# Altium schematic sheet SHEET_DISPLAYBOARD_V1beta.SchDoc
size A0
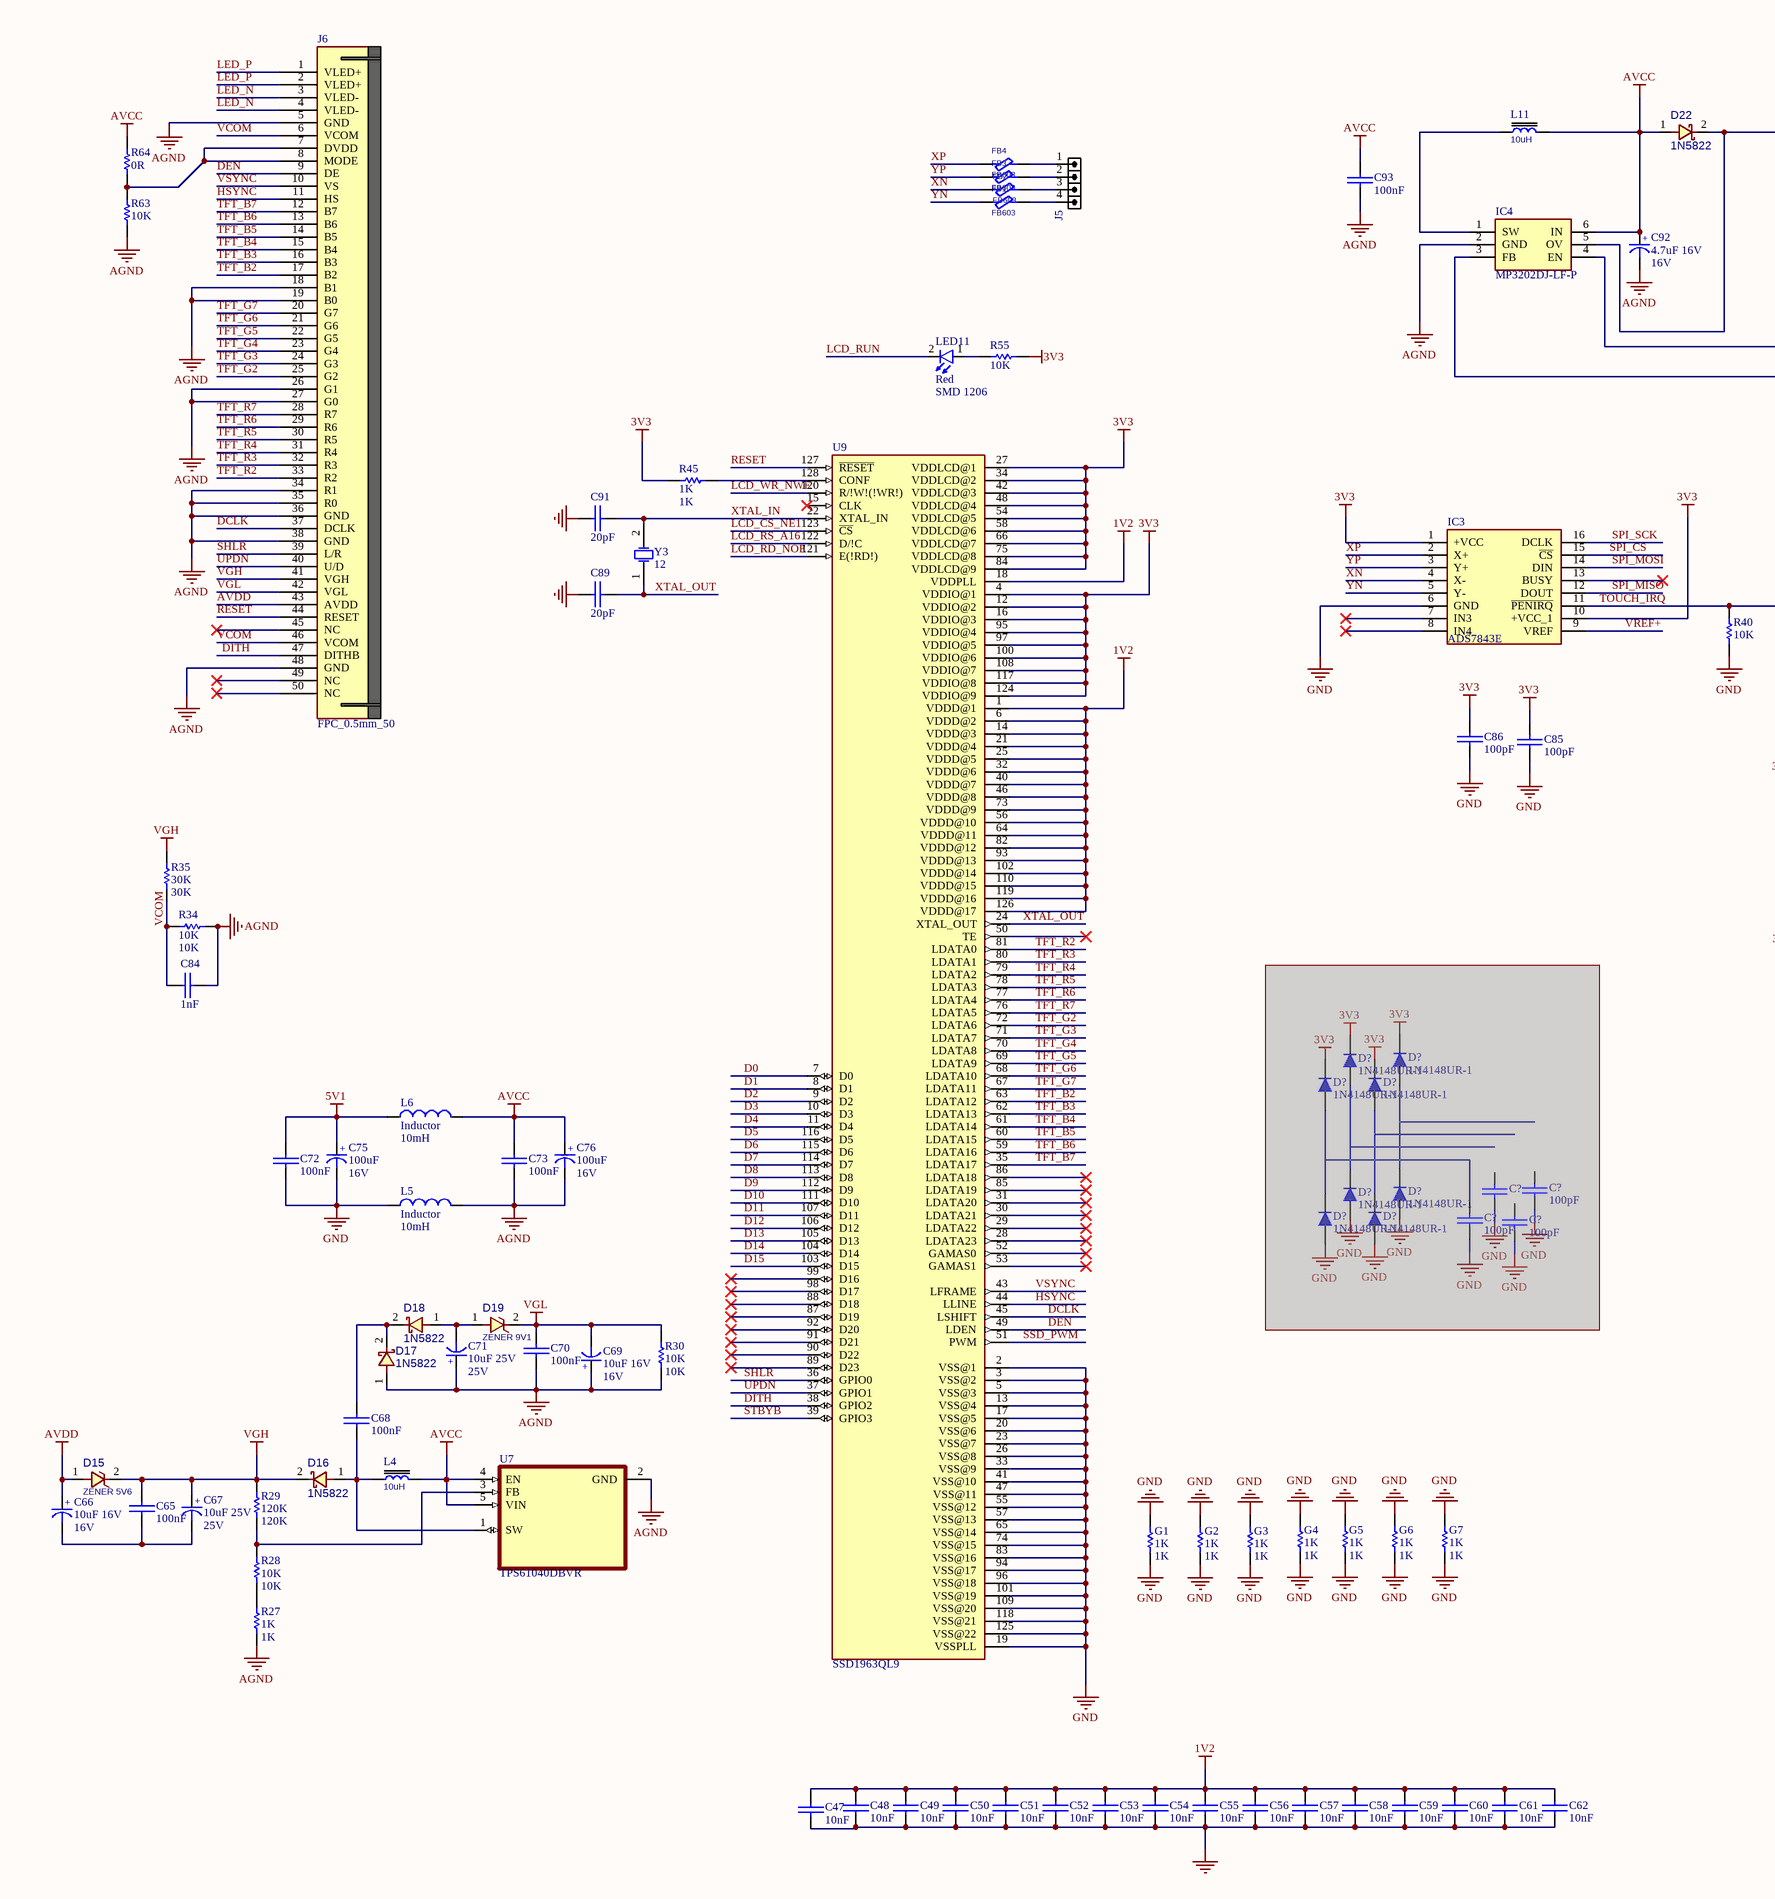
[diagram p0: SHEET_DISPLAYBOARD_V1beta.SchDoc, top left]
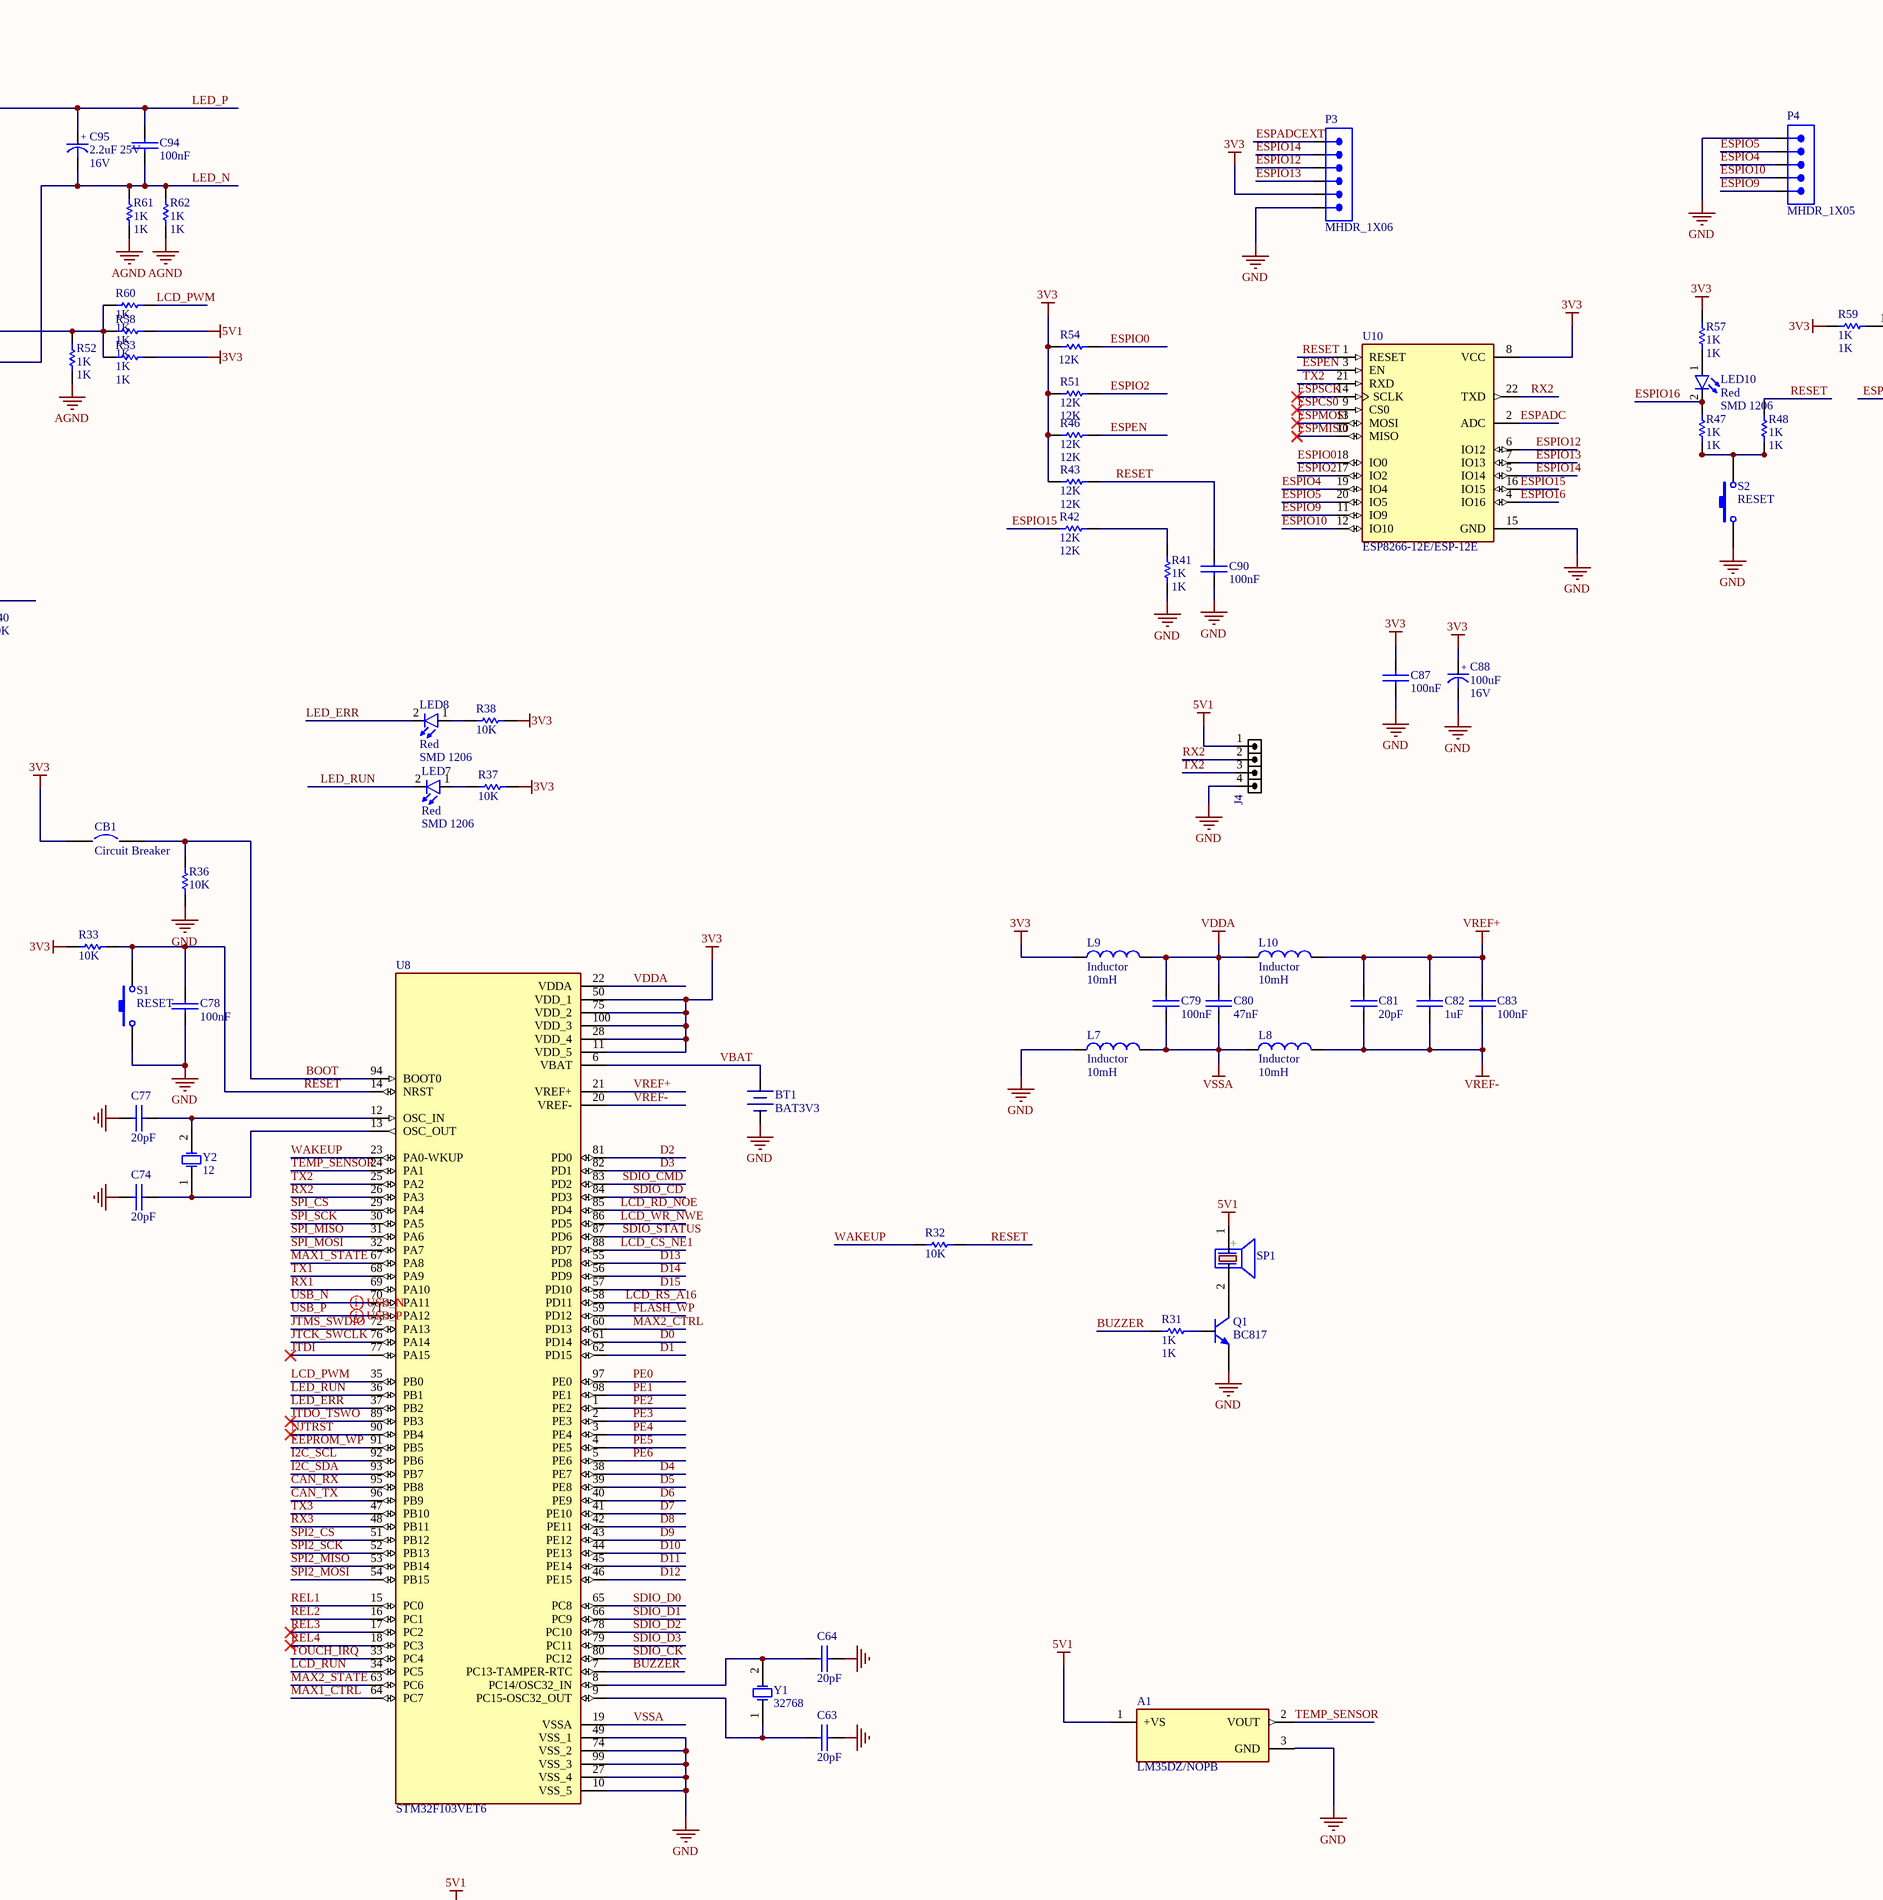
[diagram p1: SHEET_DISPLAYBOARD_V1beta.SchDoc, top middle]
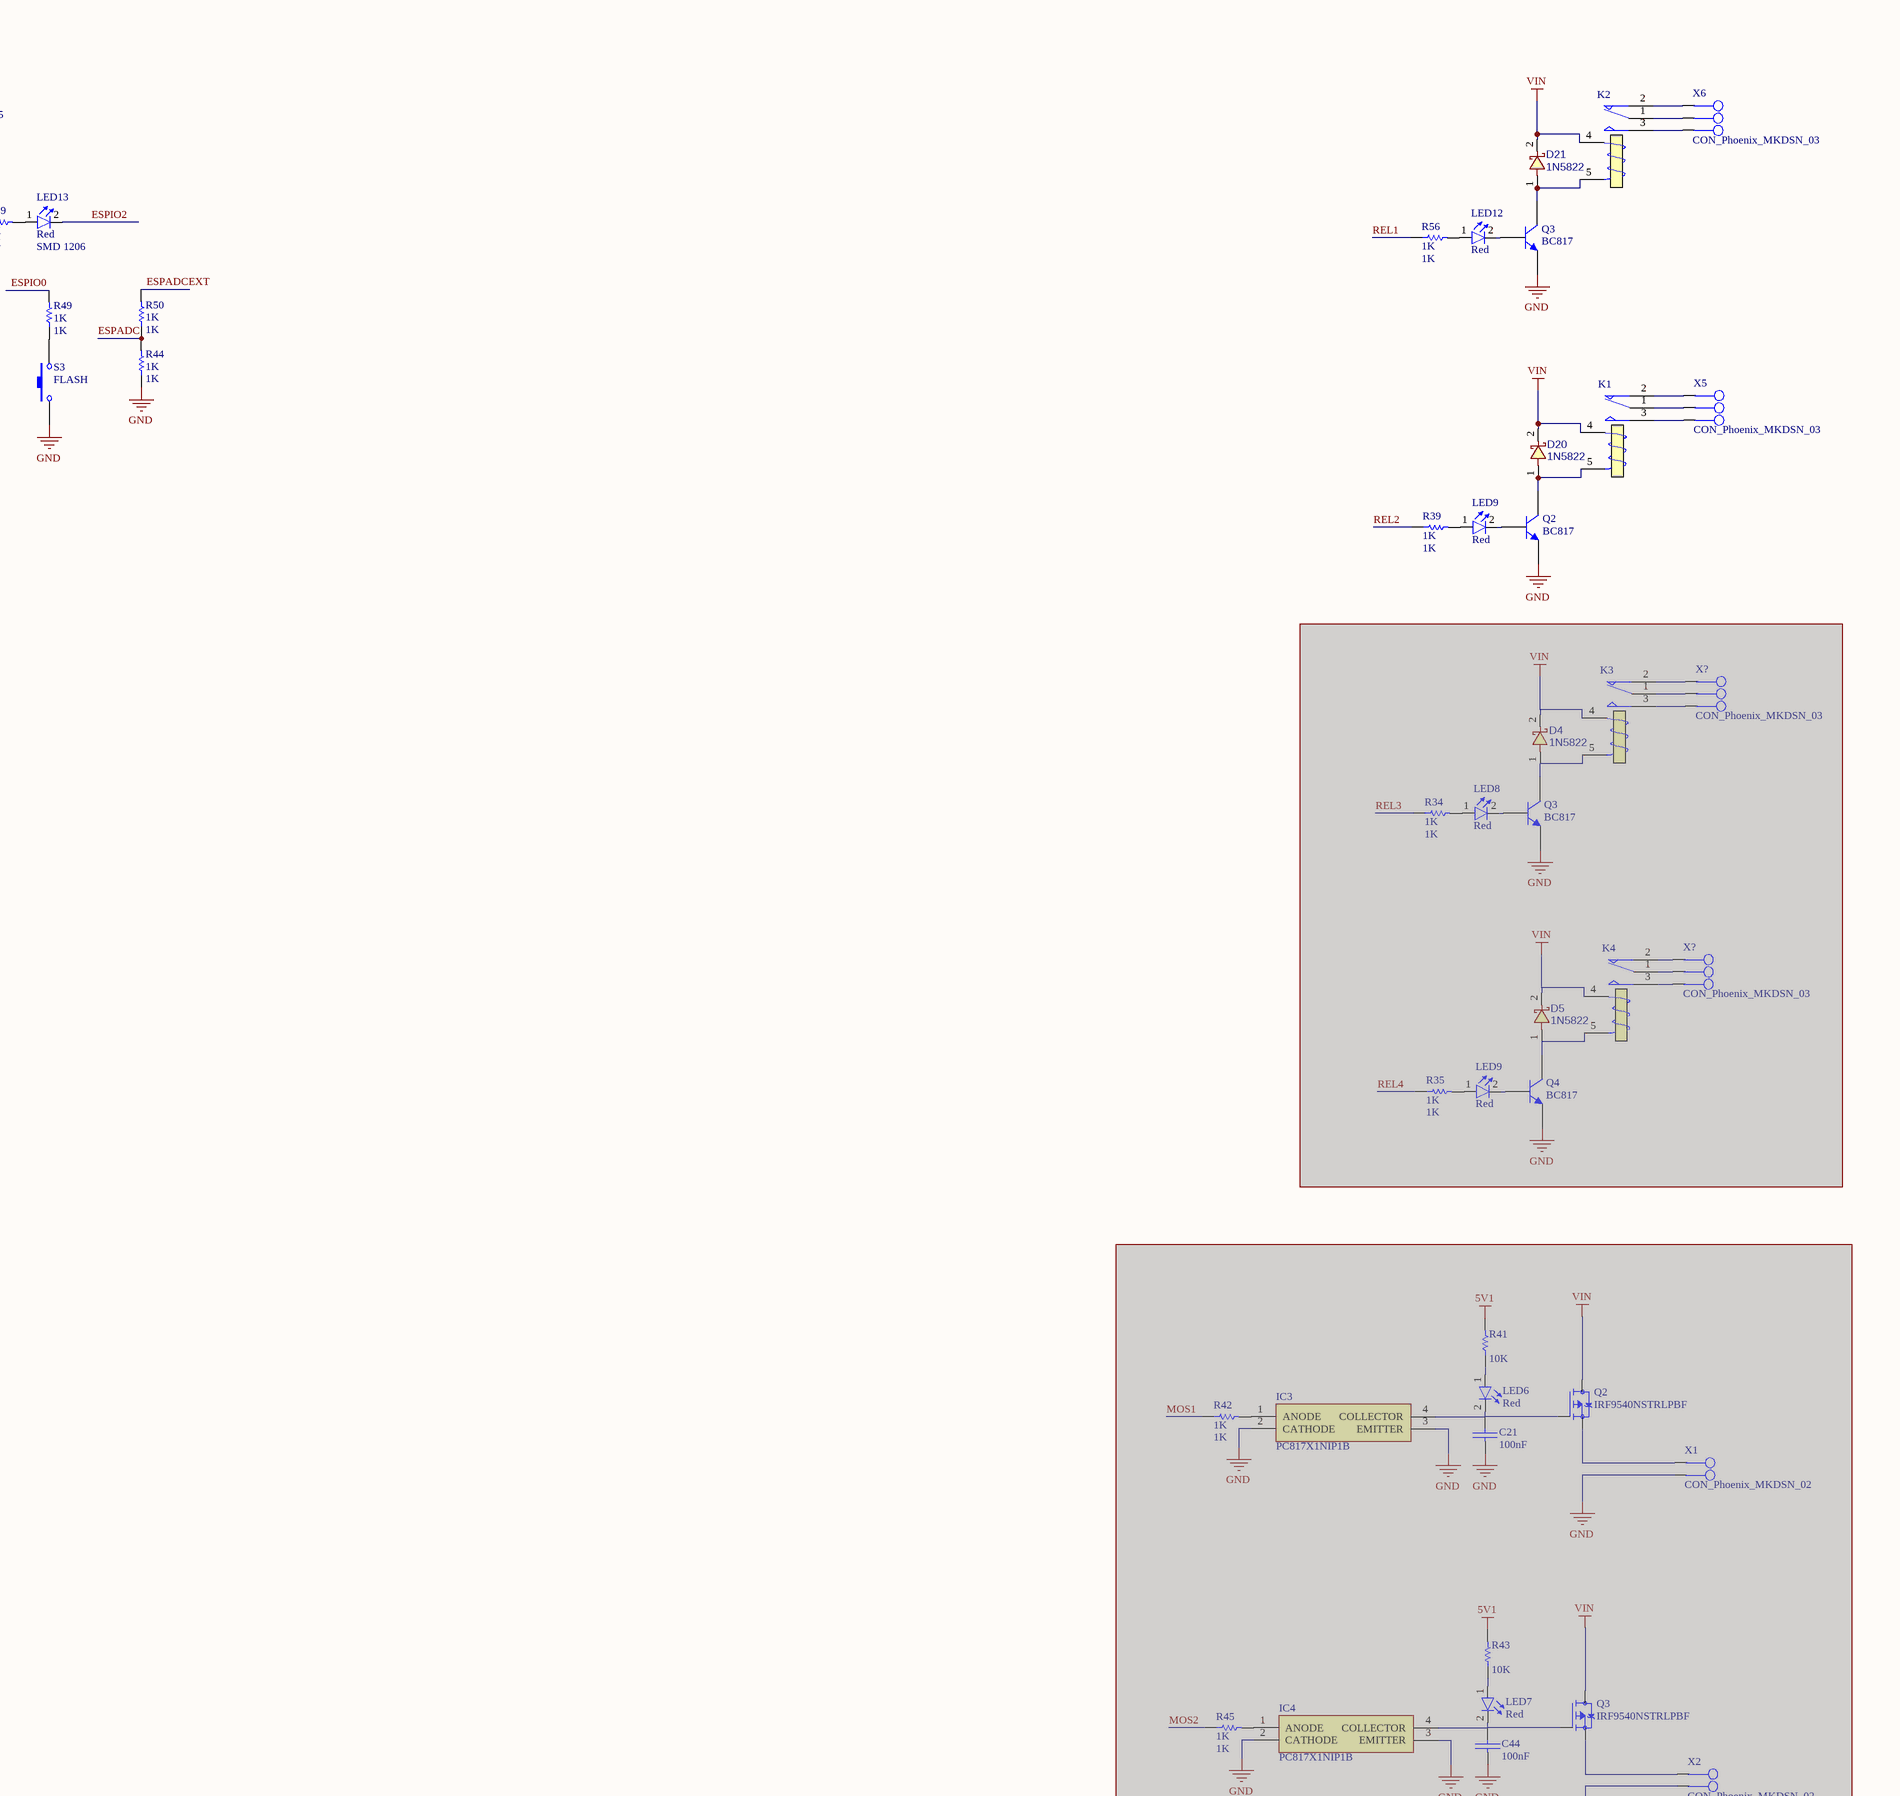
[diagram p2: SHEET_DISPLAYBOARD_V1beta.SchDoc, top right]
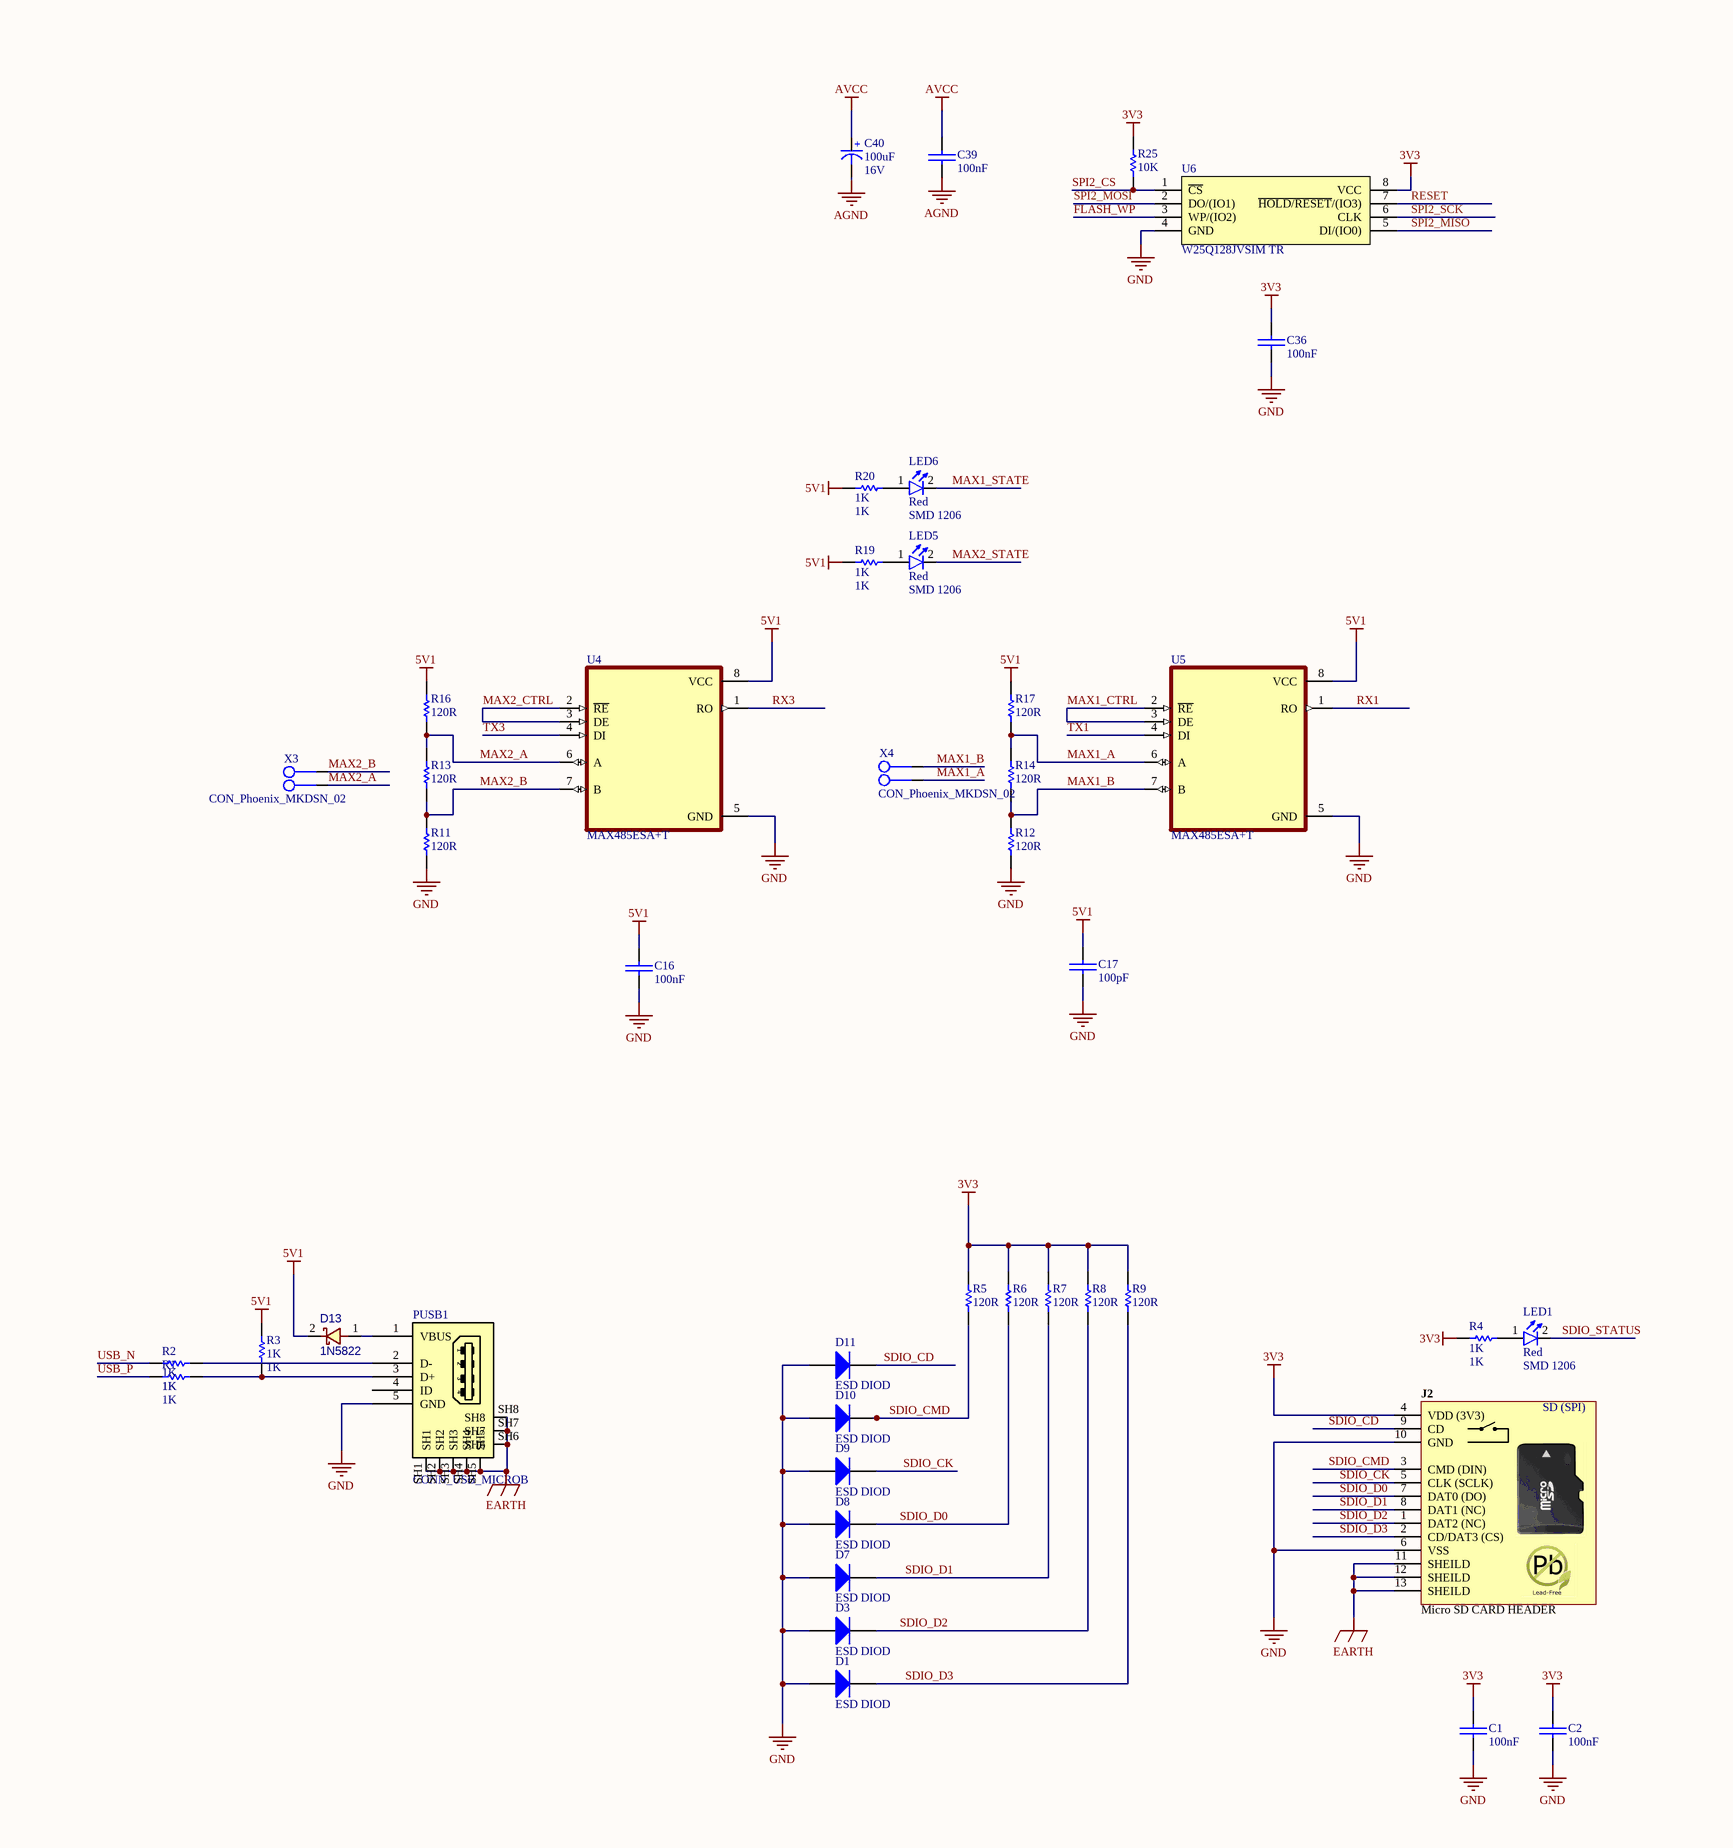
[diagram p3: SHEET_DISPLAYBOARD_V1beta.SchDoc, bottom left]
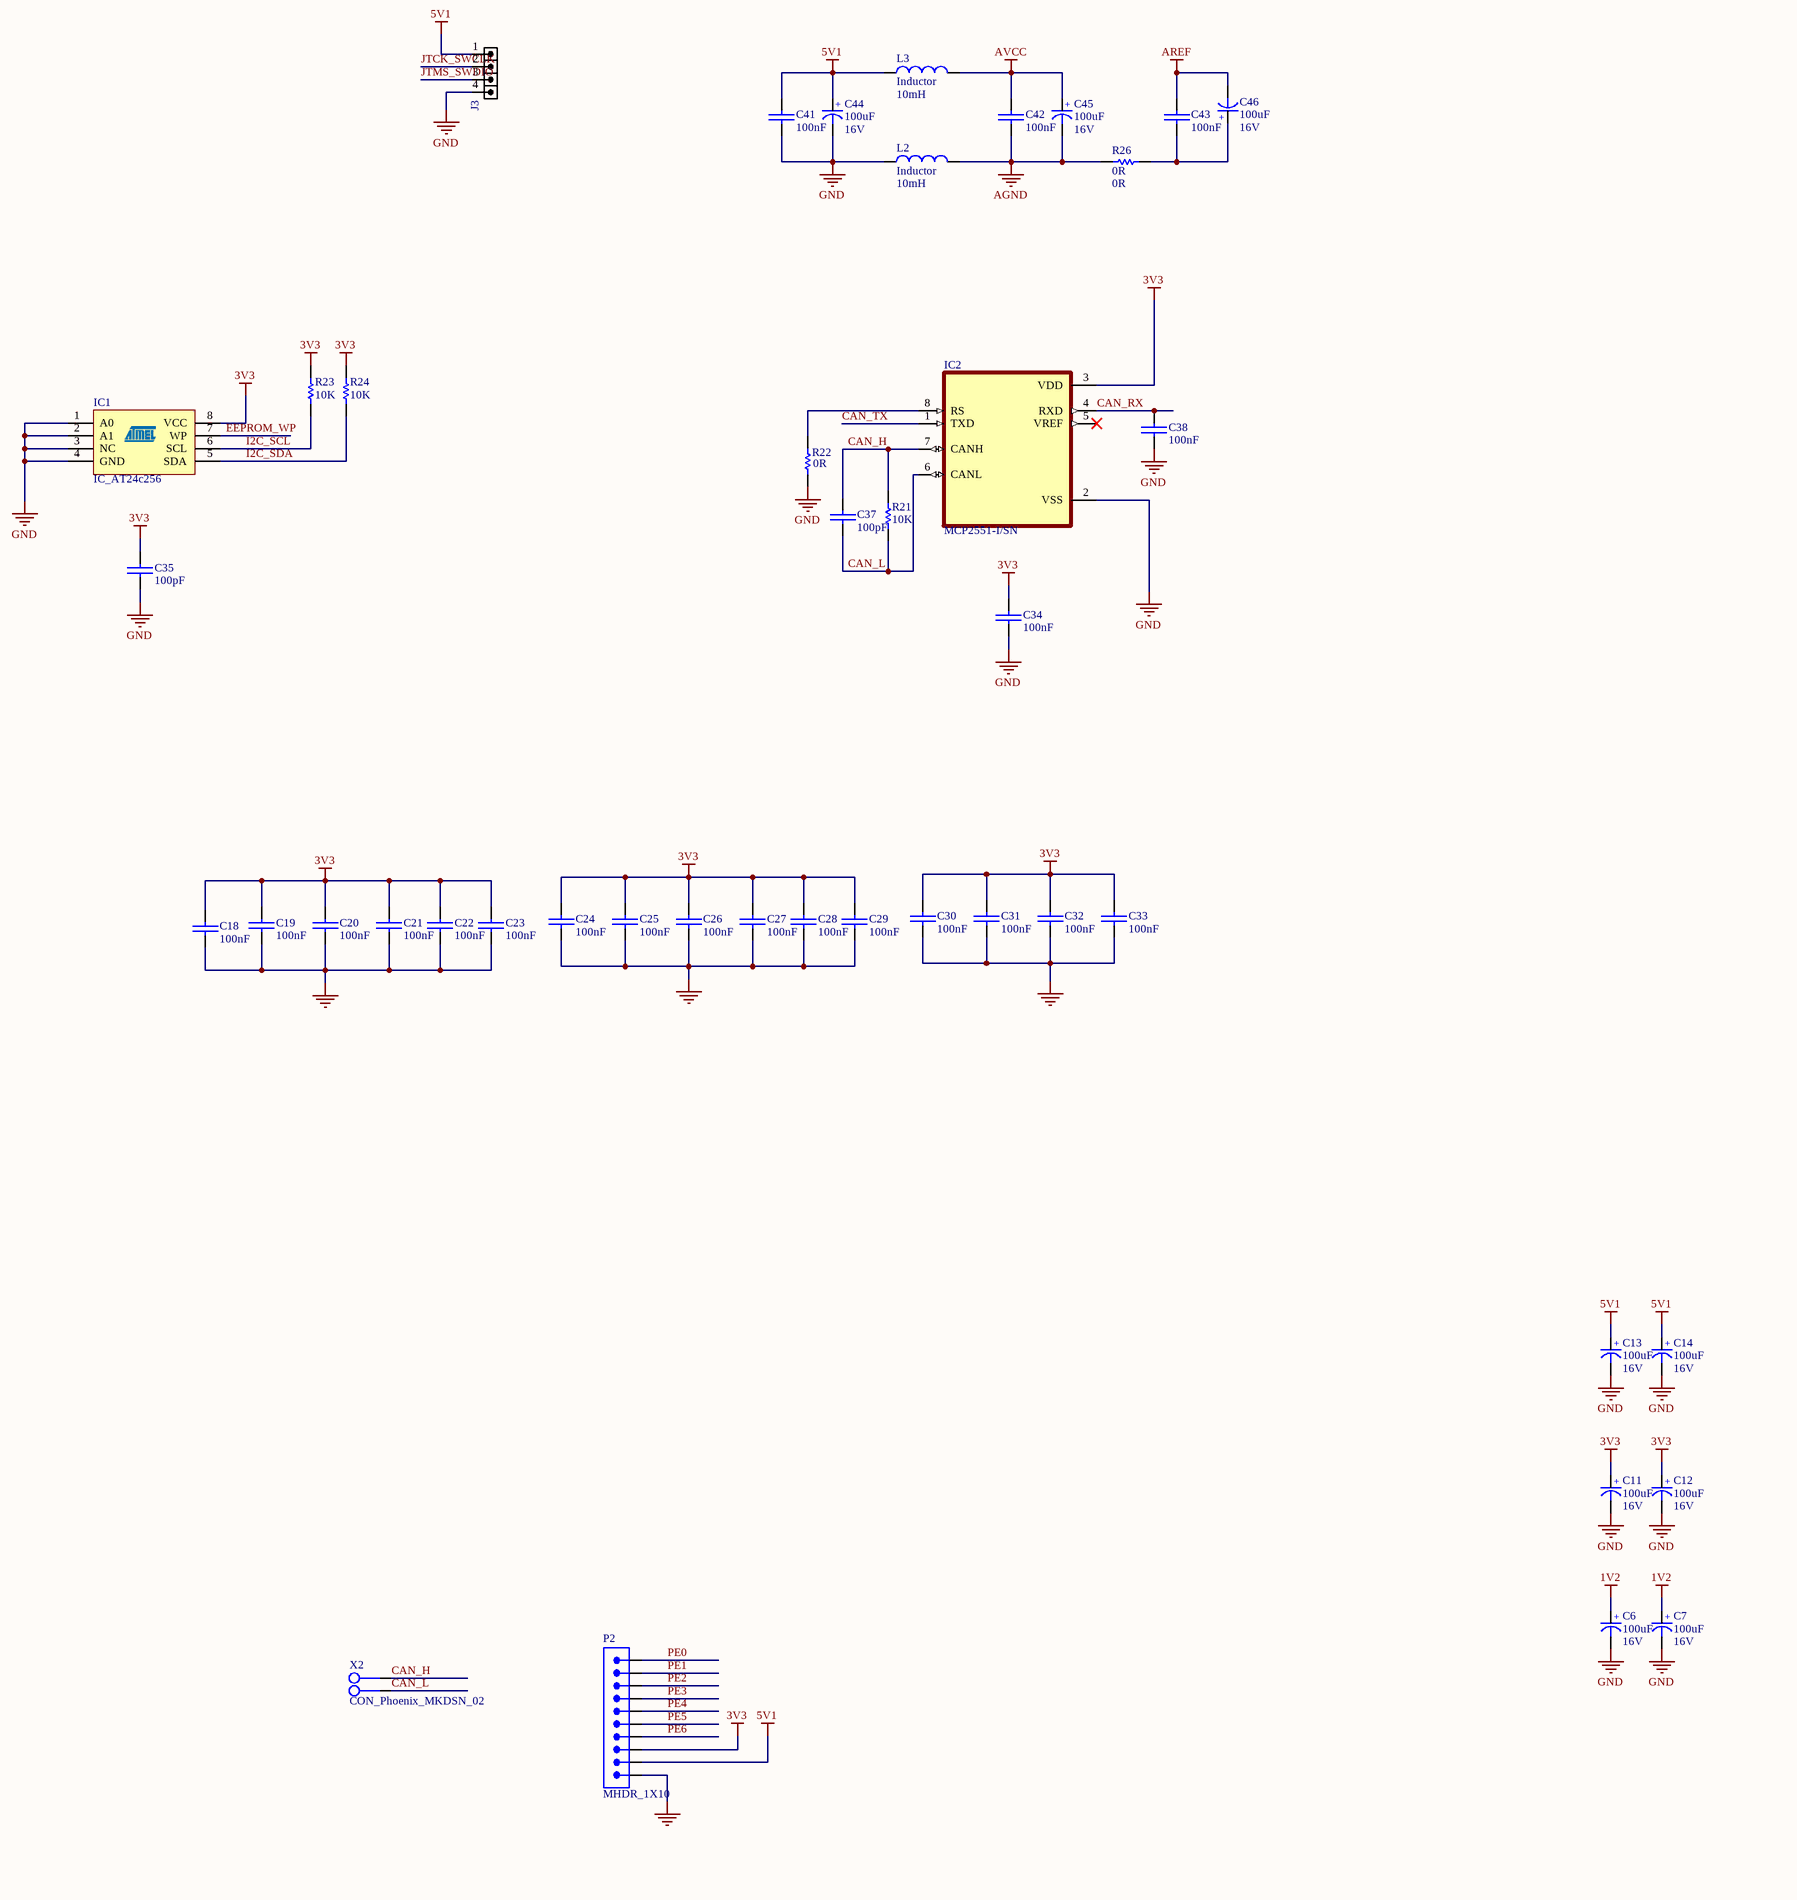
[diagram p4: SHEET_DISPLAYBOARD_V1beta.SchDoc, bottom middle]
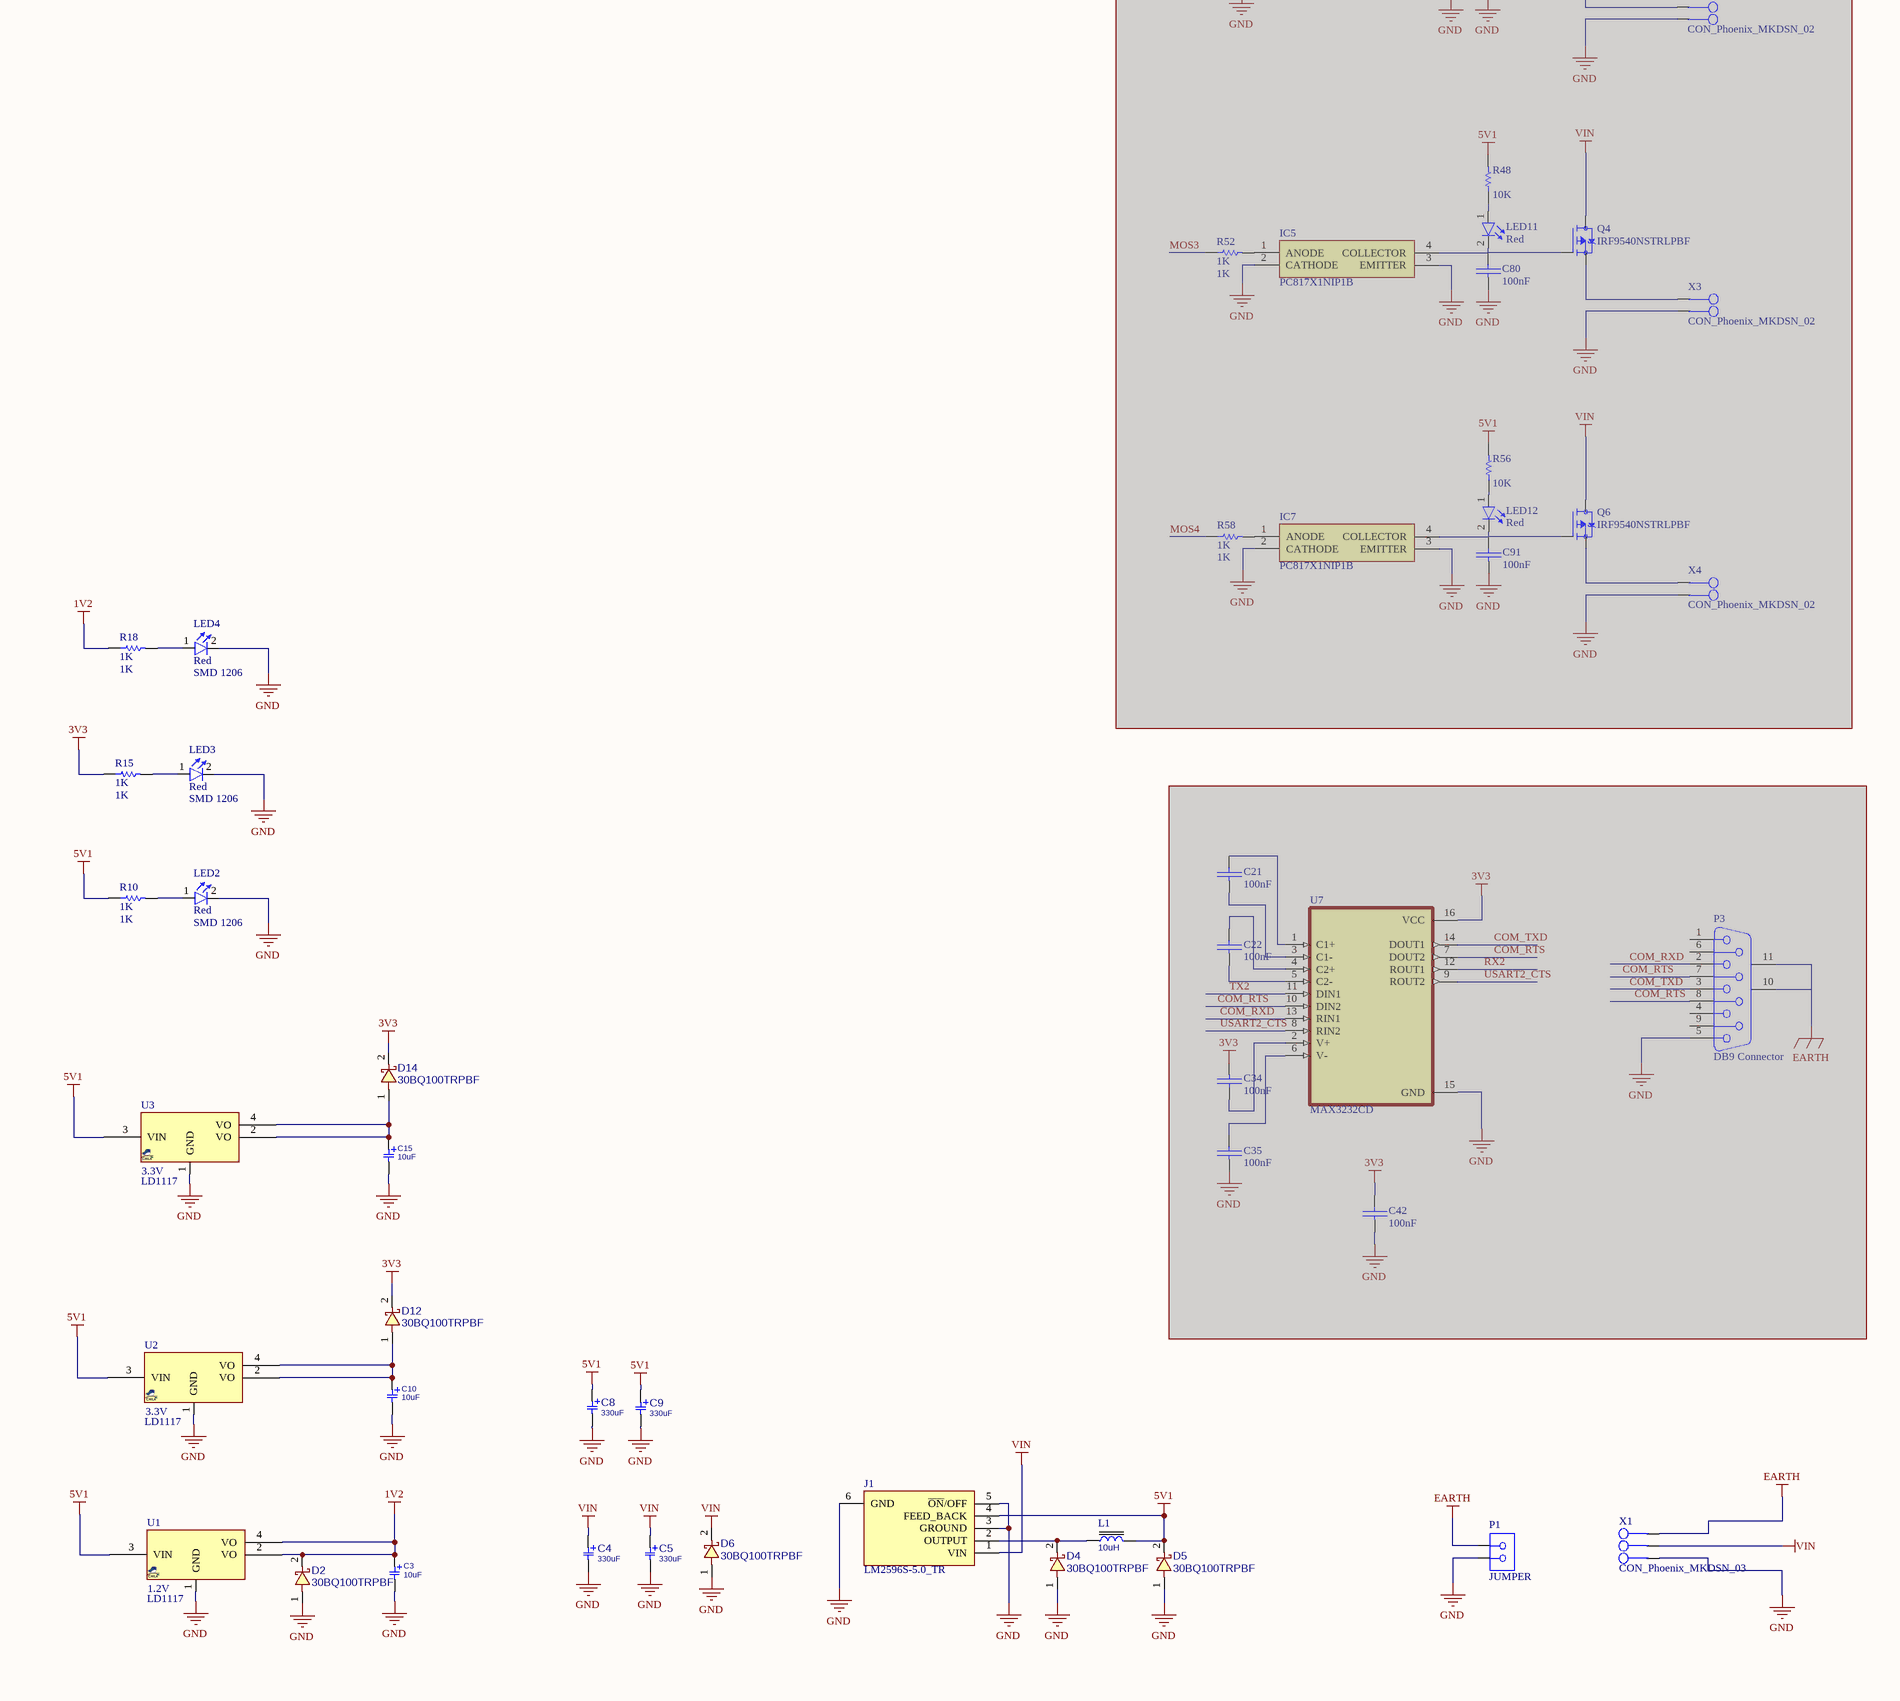
[diagram p5: SHEET_DISPLAYBOARD_V1beta.SchDoc, bottom right]

## Parts
(Parts that share a designator on the sheet are numbered #1, #2 ... from top to bottom, then left to right.)
A1  LM35DZ/NOPB  [TO92127P521H735-3]
BT1  BAT3V3  [BTH2032]
C1  100nF  [SMD_CAP_1206]
C2  100nF  [SMD_CAP_1206]
C3  10uF  [C_TN_7343]
C4  330uF  [C_EL_10_12]
C5  330uF  [C_EL_10_12]
C6  Voltage: 16V  [CAPP 1206 (3216X18L) Size A]  (hidden comment: 100uF)
C7  Voltage: 16V  [CAPP 1206 (3216X18L) Size A]  (hidden comment: 100uF)
C8  330uF  [C_EL_10_12]
C9  330uF  [C_EL_10_12]
C10  10uF  [C_TN_7343]
C11  Voltage: 16V  [CAPP 1206 (3216X18L) Size A]  (hidden comment: 100uF)
C12  Voltage: 16V  [CAPP 1206 (3216X18L) Size A]  (hidden comment: 100uF)
C13  Voltage: 16V  [CAPP 1206 (3216X18L) Size A]  (hidden comment: 100uF)
C14  Voltage: 16V  [CAPP 1206 (3216X18L) Size A]  (hidden comment: 100uF)
C15  10uF  [C_TN_7343]
C16  100nF  [SMD_CAP_1206]
C17  100pF  [SMD_CAP_1206]
C18  100nF  [SMD_CAP_1206]
C19  100nF  [SMD_CAP_1206]
C20  100nF  [SMD_CAP_1206]
C21#1  100nF  [SMD_CAP_1206]  (masked out: inside a compile mask, not in the netlist)
C21#2  100nF  [SMD_CAP_1206]
C21#3  100nF  [SMD_CAP_1206]  (masked out: inside a compile mask, not in the netlist)
C22#1  100nF  [SMD_CAP_1206]
C22#2  100nF  [SMD_CAP_1206]  (masked out: inside a compile mask, not in the netlist)
C23  100nF  [SMD_CAP_1206]
C24  100nF  [SMD_CAP_1206]
C25  100nF  [SMD_CAP_1206]
C26  100nF  [SMD_CAP_1206]
C27  100nF  [SMD_CAP_1206]
C28  100nF  [SMD_CAP_1206]
C29  100nF  [SMD_CAP_1206]
C30  100nF  [SMD_CAP_1206]
C31  100nF  [SMD_CAP_1206]
C32  100nF  [SMD_CAP_1206]
C33  100nF  [SMD_CAP_1206]
C34#1  100nF  [SMD_CAP_1206]
C34#2  100nF  [SMD_CAP_1206]  (masked out: inside a compile mask, not in the netlist)
C35#1  100pF  [SMD_CAP_1206]
C35#2  100nF  [SMD_CAP_1206]  (masked out: inside a compile mask, not in the netlist)
C36  100nF  [SMD_CAP_1206]
C37  100pF  [SMD_CAP_1206]
C38  100nF  [SMD_CAP_1206]
C39  100nF  [SMD_CAP_1206]
C40  Voltage: 16V  [CAPP 1206 (3216X18L) Size A]  (hidden comment: 100uF)
C41  100nF  [SMD_CAP_1206]
C42#1  100nF  [SMD_CAP_1206]
C42#2  100nF  [SMD_CAP_1206]  (masked out: inside a compile mask, not in the netlist)
C43  100nF  [SMD_CAP_1206]
C44#1  100nF  [SMD_CAP_1206]  (masked out: inside a compile mask, not in the netlist)
C44#2  Voltage: 16V  [CAPP 1206 (3216X18L) Size A]  (hidden comment: 100uF)
C45  Voltage: 16V  [CAPP 1206 (3216X18L) Size A]  (hidden comment: 100uF)
C46  Voltage: 16V  [CAPP 1206 (3216X18L) Size A]  (hidden comment: 100uF)
C47  10nF  [SMD_CAP_1206]
C48  10nF  [SMD_CAP_1206]
C49  10nF  [SMD_CAP_1206]
C50  10nF  [SMD_CAP_1206]
C51  10nF  [SMD_CAP_1206]
C52  10nF  [SMD_CAP_1206]
C53  10nF  [SMD_CAP_1206]
C54  10nF  [SMD_CAP_1206]
C55  10nF  [SMD_CAP_1206]
C56  10nF  [SMD_CAP_1206]
C57  10nF  [SMD_CAP_1206]
C58  10nF  [SMD_CAP_1206]
C59  10nF  [SMD_CAP_1206]
C60  10nF  [SMD_CAP_1206]
C61  10nF  [SMD_CAP_1206]
C62  10nF  [SMD_CAP_1206]
C63  20pF  [SMD_CAP_1206]
C64  20pF  [SMD_CAP_1206]
C65  100nF  [SMD_CAP_1206]
C66  Voltage: 16V  [CAPP 1206 (3216X18L) Size A]  (hidden comment: 10uF 16V)
C67  Voltage: 25V  [CAPP 1206 (3216X18L) Size A]  (hidden comment: 10uF 25V)
C68  100nF  [SMD_CAP_1206]
C69  Voltage: 16V  [CAPP 1206 (3216X18L) Size A]  (hidden comment: 10uF 16V)
C70  100nF  [SMD_CAP_1206]
C71  Voltage: 25V  [CAPP 1206 (3216X18L) Size A]  (hidden comment: 10uF 25V)
C72  100nF  [SMD_CAP_1206]
C73  100nF  [SMD_CAP_1206]
C74  20pF  [SMD_CAP_1206]
C75  Voltage: 16V  [CAPP 1206 (3216X18L) Size A]  (hidden comment: 100uF)
C76  Voltage: 16V  [CAPP 1206 (3216X18L) Size A]  (hidden comment: 100uF)
C77  20pF  [SMD_CAP_1206]
C78  100nF  [SMD_CAP_1206]
C79  100nF  [SMD_CAP_1206]
C80#1  47nF  [SMD_CAP_1206]
C80#2  100nF  [SMD_CAP_1206]  (masked out: inside a compile mask, not in the netlist)
C81  20pF  [SMD_CAP_1206]
C82  1uF  [SMD_CAP_1206]
C83  100nF  [SMD_CAP_1206]
C84  1nF  [SMD_CAP_1206]
C85  100pF  [SMD_CAP_1206]
C86  100pF  [SMD_CAP_1206]
C87  100nF  [SMD_CAP_1206]
C88  Voltage: 16V  [CAPP 1206 (3216X18L) Size A]  (hidden comment: 100uF)
C89  20pF  [SMD_CAP_1206]
C90  100nF  [SMD_CAP_1206]
C91#1  20pF  [SMD_CAP_1206]
C91#2  100nF  [SMD_CAP_1206]  (masked out: inside a compile mask, not in the netlist)
C92  Voltage: 16V  [CAPP 1206 (3216X18L) Size A]  (hidden comment: 4.7uF 16V)
C93  100nF  [SMD_CAP_1206]
C94  100nF  [SMD_CAP_1206]
C95  Voltage: 16V  [CAPP 1206 (3216X18L) Size A]  (hidden comment: 2.2uF 25V)
C?#1  (no value)  [SMD_CAP_1206]  (masked out: inside a compile mask, not in the netlist)
C?#2  100pF  [SMD_CAP_1206]  (masked out: inside a compile mask, not in the netlist)
C?#3  100pF  [SMD_CAP_1206]  (masked out: inside a compile mask, not in the netlist)
C?#4  100pF  [SMD_CAP_1206]  (masked out: inside a compile mask, not in the netlist)
CB1  Circuit Breaker  [Jumper Small - 2.54 - Black]
D1  ESD DIOD  [LL4148]
D2  30BQ100TRPBF  [D_SMC]
D3  ESD DIOD  [LL4148]
D4#1  1N5822  [D_SMA]  (masked out: inside a compile mask, not in the netlist)
D4#2  30BQ100TRPBF  [D_SMC]
D5#1  1N5822  [D_SMA]  (masked out: inside a compile mask, not in the netlist)
D5#2  30BQ100TRPBF  [D_SMC]
D6  30BQ100TRPBF  [D_SMC]
D7  ESD DIOD  [LL4148]
D8  ESD DIOD  [LL4148]
D9  ESD DIOD  [LL4148]
D10  ESD DIOD  [LL4148]
D11  ESD DIOD  [LL4148]
D12  30BQ100TRPBF  [D_SMC]
D13  1N5822  [D_SMA]
D14  30BQ100TRPBF  [D_SMC]
D15  ZENER 5V6  [D_SMA]
D16  1N5822  [D_SMA]
D17  1N5822  [D_SMA]
D18  1N5822  [D_SMA]
D19  ZENER 9V1  [D_SMA]
D20  1N5822  [D_SMA]
D21  1N5822  [D_SMA]
D22  1N5822  [D_SMA]
D?#1  1N4148UR-1  [SOD80, LL-34]  (masked out: inside a compile mask, not in the netlist)
D?#2  1N4148UR-1  [SOD80, LL-34]  (masked out: inside a compile mask, not in the netlist)
D?#3  1N4148UR-1  [SOD80, LL-34]  (masked out: inside a compile mask, not in the netlist)
D?#4  1N4148UR-1  [SOD80, LL-34]  (masked out: inside a compile mask, not in the netlist)
D?#5  1N4148UR-1  [SOD80, LL-34]  (masked out: inside a compile mask, not in the netlist)
D?#6  1N4148UR-1  [SOD80, LL-34]  (masked out: inside a compile mask, not in the netlist)
D?#7  1N4148UR-1  [SOD80, LL-34]  (masked out: inside a compile mask, not in the netlist)
D?#8  1N4148UR-1  [SOD80, LL-34]  (masked out: inside a compile mask, not in the netlist)
FB1  FB603  [L1206]
FB2  FB603  [L1206]
FB3  FB603  [L1206]
FB4  FB603  [L1206]
G1  1K  [RES1206]
G2  1K  [RES1206]
G3  1K  [RES1206]
G4  1K  [RES1206]
G5  1K  [RES1206]
G6  1K  [RES1206]
G7  1K  [RES1206]
IC1  IC_AT24c256  [SO8_NARROW_M]
IC2  MCP2551-I/SN  [SOIC127P599X175-8N]
IC3#1  ADS7843E  [SOP64P600X175-16N]
IC3#2  PC817X1NIP1B  [SMT Gullwing Lead-Form]  (masked out: inside a compile mask, not in the netlist)
IC4#1  MP3202DJ-LF-P  [SOT95P280X100-6N]
IC4#2  PC817X1NIP1B  [SMT Gullwing Lead-Form]  (masked out: inside a compile mask, not in the netlist)
IC5  PC817X1NIP1B  [SMT Gullwing Lead-Form]  (masked out: inside a compile mask, not in the netlist)
IC7  PC817X1NIP1B  [SMT Gullwing Lead-Form]  (masked out: inside a compile mask, not in the netlist)
J1  LM2596S-5.0_TR  [LM2596S50TR]
J2  Micro SD CARD HEADER  [SMD_CON_Micro SD -Push-Push]
J3  HDR1X4  [HDR_M_1X4]  (value not drawn)
J4  HDR1X4  [HDR_M_1X4]  (value not drawn)
J5  HDR1X4  [HDR_M_1X4]  (value not drawn)
J6  FPC_0.5mm_50  [FPC50_50]
K1  (no value)  [Relay 18.85x15.35x15.70]
K2  (no value)  [Relay 18.85x15.35x15.70]
K3  (no value)  [Relay 18.85x15.35x15.70]  (masked out: inside a compile mask, not in the netlist)
K4  (no value)  [Relay 18.85x15.35x15.70]  (masked out: inside a compile mask, not in the netlist)
L1  10uH  [L_12]
L2  Inductor  value 10mH  [INDC3216]
L3  Inductor  value 10mH  [INDC3216]
L4  10uH  [L_12]
L5  Inductor  value 10mH  [INDC3216]
L6  Inductor  value 10mH  [INDC3216]
L7  Inductor  value 10mH  [INDC3216]
L8  Inductor  value 10mH  [INDC3216]
L9  Inductor  value 10mH  [INDC3216]
L10  Inductor  value 10mH  [INDC3216]
L11  10uH  [L_12]
LED1  Size: SMD 1206  [LED SMD 1206]  (hidden comment: Red)
LED2  Size: SMD 1206  [LED SMD 1206]  (hidden comment: Red)
LED3  Size: SMD 1206  [LED SMD 1206]  (hidden comment: Red)
LED4  Size: SMD 1206  [LED SMD 1206]  (hidden comment: Red)
LED5  Size: SMD 1206  [LED SMD 1206]  (hidden comment: Red)
LED6#1  Red  [LED SMD 1206]  (masked out: inside a compile mask, not in the netlist)
LED6#2  Size: SMD 1206  [LED SMD 1206]  (hidden comment: Red)
LED7#1  Size: SMD 1206  [LED SMD 1206]  (hidden comment: Red)
LED7#2  Red  [LED SMD 1206]  (masked out: inside a compile mask, not in the netlist)
LED8#1  Size: SMD 1206  [LED SMD 1206]  (hidden comment: Red)
LED8#2  Red  [LED SMD 1206]  (masked out: inside a compile mask, not in the netlist)
LED9#1  Red  [LED SMD 1206]
LED9#2  Red  [LED SMD 1206]  (masked out: inside a compile mask, not in the netlist)
LED10  Size: SMD 1206  [LED SMD 1206]  (hidden comment: Red)
LED11#1  Size: SMD 1206  [LED SMD 1206]  (hidden comment: Red)
LED11#2  Red  [LED SMD 1206]  (masked out: inside a compile mask, not in the netlist)
LED12#1  Red  [LED SMD 1206]
LED12#2  Red  [LED SMD 1206]  (masked out: inside a compile mask, not in the netlist)
LED13  Size: SMD 1206  [LED SMD 1206]  (hidden comment: Red)
P1  JUMPER  [FHDR1X02-254P]
P2  MHDR_1X10  [MHDR1X10-254P - E]
P3#1  MHDR_1X06  [MHDR1X06-254P]
P3#2  DB9 Connector  [DB9 Male]  (masked out: inside a compile mask, not in the netlist)
P4  MHDR_1X05  [MHDR1X05-254P]
PUSB1  CONN_USB_MICROB  [USB_MICRO_AB_BM_SHS]
Q1  BC817  [SOT23_BEC_L]
Q2#1  BC817  [SOT23_BEC_L]
Q2#2  IRF9540NSTRLPBF  [DPAK254P1524X483-4_3N]  (masked out: inside a compile mask, not in the netlist)
Q3#1  BC817  [SOT23_BEC_L]
Q3#2  BC817  [SOT23_BEC_L]  (masked out: inside a compile mask, not in the netlist)
Q3#3  IRF9540NSTRLPBF  [DPAK254P1524X483-4_3N]  (masked out: inside a compile mask, not in the netlist)
Q4#1  BC817  [SOT23_BEC_L]  (masked out: inside a compile mask, not in the netlist)
Q4#2  IRF9540NSTRLPBF  [DPAK254P1524X483-4_3N]  (masked out: inside a compile mask, not in the netlist)
Q6  IRF9540NSTRLPBF  [DPAK254P1524X483-4_3N]  (masked out: inside a compile mask, not in the netlist)
R1  1K  [RES1206]
R2  1K  [RES1206]
R3  1K  [RES1206]
R4  1K  [RES1206]
R5  value 120R  [RES1206]
R6  value 120R  [RES1206]
R7  value 120R  [RES1206]
R8  value 120R  [RES1206]
R9  value 120R  [RES1206]
R10  1K  [RES1206]
R11  value 120R  [RES1206]
R12  value 120R  [RES1206]
R13  value 120R  [RES1206]
R14  value 120R  [RES1206]
R15  1K  [RES1206]
R16  value 120R  [RES1206]
R17  value 120R  [RES1206]
R18  1K  [RES1206]
R19  1K  [RES1206]
R20  1K  [RES1206]
R21  10K  [RES1206]
R22  value 0R  [RES1206]
R23  10K  [RES1206]
R24  10K  [RES1206]
R25  10K  [RES1206]
R26  0R  [RES1206]
R27  1K  [RES1206]
R28  10K  [RES1206]
R29  120K  [RES1206]
R30  10K  [RES1206]
R31  1K  [RES1206]
R32  10K  [RES1206]
R33  10K  [RES1206]
R34#1  10K  [RES1206]
R34#2  1K  [RES1206]  (masked out: inside a compile mask, not in the netlist)
R35#1  30K  [RES1206]
R35#2  1K  [RES1206]  (masked out: inside a compile mask, not in the netlist)
R36  10K  [RES1206]
R37  value 10K  [RES1206]
R38  value 10K  [RES1206]
R39  1K  [RES1206]
R40  10K  [RES1206]
R41#1  1K  [RES1206]
R41#2  value 10K  [RES1206]  (masked out: inside a compile mask, not in the netlist)
R42#1  12K  [RES1206]
R42#2  1K  [RES1206]  (masked out: inside a compile mask, not in the netlist)
R43#1  12K  [RES1206]
R43#2  value 10K  [RES1206]  (masked out: inside a compile mask, not in the netlist)
R44  1K  [RES1206]
R45#1  1K  [RES1206]
R45#2  1K  [RES1206]  (masked out: inside a compile mask, not in the netlist)
R46  12K  [RES1206]
R47  1K  [RES1206]
R48#1  1K  [RES1206]
R48#2  value 10K  [RES1206]  (masked out: inside a compile mask, not in the netlist)
R49  1K  [RES1206]
R50  1K  [RES1206]
R51  12K  [RES1206]
R52#1  1K  [RES1206]
R52#2  1K  [RES1206]  (masked out: inside a compile mask, not in the netlist)
R53  1K  [RES1206]
R54  12K  [RES1206]
R55  value 10K  [RES1206]
R56#1  1K  [RES1206]
R56#2  value 10K  [RES1206]  (masked out: inside a compile mask, not in the netlist)
R57  1K  [RES1206]
R58#1  1K  [RES1206]
R58#2  1K  [RES1206]  (masked out: inside a compile mask, not in the netlist)
R59  1K  [RES1206]
R60  1K  [RES1206]
R61  1K  [RES1206]
R62  1K  [RES1206]
R63  value 10K  [RES1206]
R64  value 0R  [RES1206]
S1  RESET  [SW-PB]
S2  RESET  [SW-PB]
S3  FLASH  [SW-PB]
SP1  (no value)  [BUZZER 7.62mm DC]
U1  1.2V  value LD1117  [SOT223_4]
U2  3.3V  value LD1117  [SOT223_4]
U3  3.3V  value LD1117  [SOT223_4]
U4  MAX485ESA+T  [SOIC127P600X175-8N]
U5  MAX485ESA+T  [SOIC127P600X175-8N]
U6  W25Q128JVSIM TR  [SOIC127P600X175-8N]
U7#1  TPS61040DBVR  [SOT95P280X145-5N]
U7#2  MAX3232CD  [SOIC127P600X175-16N]  (masked out: inside a compile mask, not in the netlist)
U8  STM32F103VET6  [QFP50P1600X1600X160-100N]
U9  SSD1963QL9  [QFP40P1600X1600X160-128N]
U10  ESP8266-12E/ESP-12E  [XCVR_ESP8266-12E/ESP-12E]
X1#1  CON_Phoenix_MKDSN_02  [CON_MKDSN1,5/2-5,08]  (masked out: inside a compile mask, not in the netlist)
X1#2  CON_Phoenix_MKDSN_03  [CON_MKDSN1,5/3-5,08]
X2#1  CON_Phoenix_MKDSN_02  [CON_MKDSN1,5/2-5,08]  (masked out: inside a compile mask, not in the netlist)
X2#2  CON_Phoenix_MKDSN_02  [CON_MKDSN1,5/2-5,08]
X3#1  CON_Phoenix_MKDSN_02  [CON_MKDSN1,5/2-5,08]  (masked out: inside a compile mask, not in the netlist)
X3#2  CON_Phoenix_MKDSN_02  [CON_MKDSN1,5/2-5,08]
X4#1  CON_Phoenix_MKDSN_02  [CON_MKDSN1,5/2-5,08]  (masked out: inside a compile mask, not in the netlist)
X4#2  CON_Phoenix_MKDSN_02  [CON_MKDSN1,5/2-5,08]
X5  CON_Phoenix_MKDSN_03  [CON_MKDSN1,5/3-5,08]
X6  CON_Phoenix_MKDSN_03  [CON_MKDSN1,5/3-5,08]
X?#1  CON_Phoenix_MKDSN_03  [CON_MKDSN1,5/3-5,08]  (masked out: inside a compile mask, not in the netlist)
X?#2  CON_Phoenix_MKDSN_03  [CON_MKDSN1,5/3-5,08]  (masked out: inside a compile mask, not in the netlist)
Y1  32768  [XTAL RTC]
Y2  12  [XTAL Small]
Y3  12  [XTAL Small]

## Nets
1V2: C3.1 C6.1(+) C7.1(+) C47.1(+) C48.1(+) C49.1(+) C50.1(+) C51.1(+) C52.1(+) C53.1(+) C54.1(+) C55.1(+) C56.1(+) C57.1(+) C58.1(+) C59.1(+) C60.1(+) C61.1(+) C62.1(+) D2.2 R18.1 U1.2(VO) U1.4(VO) U9.1(VDDD@1) U9.6(VDDD@2) U9.14(VDDD@3) U9.18(VDDPLL) U9.21(VDDD@4) U9.25(VDDD@5) U9.32(VDDD@6) U9.40(VDDD@7) U9.46(VDDD@8) U9.56(VDDD@10) U9.64(VDDD@11) U9.73(VDDD@9) U9.82(VDDD@12) U9.93(VDDD@13) U9.102(VDDD@14) U9.110(VDDD@15) U9.119(VDDD@16) U9.126(VDDD@17)
3V3: C1.1(+) C2.1(+) C11.1(+) C12.1(+) C18.1(+) C19.1(+) C20.1(+) C21#2.1(+) C22#1.1(+) C23.1(+) C24.1(+) C25.1(+) C26.1(+) C27.1(+) C28.1(+) C29.1(+) C30.1(+) C31.1(+) C32.1(+) C33.1(+) C34#1.1(+) C35#1.1(+) C36.1(+) C85.1(+) C86.1(+) C87.1(+) C88.1(+) CB1.1 D12.2 D14.2 IC1.8(VCC) IC2.3(VDD) IC3#1.1(+VCC) IC3#1.10(+VCC_1) J2.4(VDD_(3V3)) L9.1 P2.3 P3#1.5 R4.1 R5.1 R6.1 R7.1 R8.1 R9.1 R15.1 R23.2 R24.2 R25.2 R33.1 R37.2 R38.2 R43#1.1 R45#1.1 R46.1 R51.1 R53.2 R54.1 R55.2 R57.1 R59.1 U6.8(VCC) U8.11(VDD_5) U8.28(VDD_4) U8.50(VDD_1) U8.75(VDD_2) U8.100(VDD_3) U9.4(VDDIO@1) U9.12(VDDIO@2) U9.16(VDDIO@3) U9.27(VDDLCD@1) U9.34(VDDLCD@2) U9.42(VDDLCD@3) U9.48(VDDLCD@4) U9.54(VDDLCD@5) U9.58(VDDLCD@6) U9.66(VDDLCD@7) U9.75(VDDLCD@8) U9.84(VDDLCD@9) U9.95(VDDIO@4) U9.97(VDDIO@5) U9.100(VDDIO@6) U9.108(VDDIO@7) U9.117(VDDIO@8) U9.124(VDDIO@9) U10.8(VCC)
5V1: A1.1(+VS) C8.1 C9.1 C13.1(+) C14.1(+) C16.1(+) C17.1(+) C41.1(+) C44#2.1(+) C72.1(+) C75.1(+) D5#2.2 D13.2 J1.4(FEED_BACK) J3.1 J4.1 L1.2 L3.1 L6.1 P2.2 R3.1 R10.1 R16.1 R17.1 R19.1 R20.1 R58#1.1 SP1.1(+) U1.3(VIN) U2.3(VIN) U3.3(VIN) U4.8(VCC) U5.8(VCC)
AGND: C39.2(-) C40.2(-) C42#1.2(-) C45.2(-) C69.1(+) C70.2(-) C71.1(+) C73.2(-) C76.2(-) C84.2(-) C92.2(-) C93.2(-) D17.1 IC4#1.2(GND) J6.5(GND) J6.18(B1) J6.19(B0) J6.26(G1) J6.27(G0) J6.34(R1) J6.35(R0) J6.36(GND) J6.38(GND) J6.48(GND) L2.2 L5.2 R26.1 R27.1 R30.2 R34#1.2 R52#1.1 R61.1 R62.1 R63.1 U7#1.2(GND)
AREF: C43.1(+) C46.2(-)
AVCC: C39.1(+) C40.1(+) C42#1.1(+) C45.1(+) C73.1(+) C76.1(+) C92.1(+) C93.1(+) D22.1 IC4#1.6(IN) L3.2 L4.2 L6.2 L11.2 R64.1 U7#1.4(EN) U7#1.5(VIN)
AVDD: C66.1(+) D15.1 J6.43(AVDD)
EARTH: J2.11(SHEILD) J2.12(SHEILD) J2.13(SHEILD) P1.1 PUSB1.SH1 PUSB1.SH2 PUSB1.SH3 PUSB1.SH4 PUSB1.SH5 PUSB1.SH6 PUSB1.SH7 PUSB1.SH8 X1#2.3
GND: A1.3(GND) BT1.2(-) C1.2(-) C2.2(-) C3.2 C4.2 C5.2 C6.2(-) C7.2(-) C8.2 C9.2 C10.2 C11.2(-) C12.2(-) C13.2(-) C14.2(-) C15.2 C16.2(-) C17.2(-) C18.2(-) C19.2(-) C20.2(-) C21#2.2(-) C22#1.2(-) C23.2(-) C24.2(-) C25.2(-) C26.2(-) C27.2(-) C28.2(-) C29.2(-) C30.2(-) C31.2(-) C32.2(-) C33.2(-) C34#1.2(-) C35#1.2(-) C36.2(-) C38.2(-) C41.2(-) C44#2.2(-) C47.2(-) C48.2(-) C49.2(-) C50.2(-) C51.2(-) C52.2(-) C53.2(-) C54.2(-) C55.2(-) C56.2(-) C57.2(-) C58.2(-) C59.2(-) C60.2(-) C61.2(-) C62.2(-) C63.2(-) C64.2(-) C72.2(-) C74.1(+) C75.2(-) C77.1(+) C78.2(-) C85.2(-) C86.2(-) C87.2(-) C88.2(-) C89.1(+) C90.2(-) C91#1.1(+) D1.1(A) D2.1 D3.1(A) D4#2.1 D5#2.1 D6.1 D7.1(A) D8.1(A) D9.1(A) D10.1(A) D11.1(A) G1.1 G1.2 G2.1 G2.2 G3.1 G3.2 G4.1 G4.2 G5.1 G5.2 G6.1 G6.2 G7.1 G7.2 IC1.1(A0) IC1.2(A1) IC1.3(NC) IC1.4(GND) IC2.2(VSS) IC3#1.6(GND) J1.3(GROUND) J1.5(~{ON}/OFF) J1.6(GND) J2.6(VSS) J2.10(GND) J3.4 J4.4 L2.1 L5.1 L7.1 LED2.2(K) LED3.2(K) LED4.2(K) P1.2 P2.1 P3#1.6 P4.1 PUSB1.5(GND) Q1.2(E) Q2#1.2(E) Q3#1.2(E) R11.2 R12.2 R22.1 R36.1 R40.1 R41#1.2 R44.1 S1.1 S2.1 S3.1 U1.1(GND) U2.1(GND) U3.1(GND) U4.5(GND) U5.5(GND) U6.4(GND) U8.10(VSS_5) U8.27(VSS_4) U8.49(VSS_1) U8.74(VSS_2) U8.99(VSS_3) U9.2(VSS@1) U9.3(VSS@2) U9.5(VSS@3) U9.13(VSS@4) U9.17(VSS@5) U9.19(VSSPLL) U9.20(VSS@6) U9.23(VSS@7) U9.26(VSS@8) U9.33(VSS@9) U9.41(VSS@10) U9.47(VSS@11) U9.55(VSS@12) U9.57(VSS@13) U9.65(VSS@14) U9.74(VSS@15) U9.83(VSS@16) U9.94(VSS@17) U9.96(VSS@18) U9.101(VSS@19) U9.109(VSS@20) U9.118(VSS@21) U9.125(VSS@22) U10.15(GND) X1#2.1
VDDA: C79.1(+) C80#1.1(+) L9.2 L10.1 U8.22(VDDA)
VGH: C65.1(+) C67.1(+) D15.2 D16.2 J6.41(VGH) R29.1 R35#1.2
VGL: C69.2(-) C70.1(+) D19.2 J6.42(VGL) R30.1
VIN: C4.1 C5.1 D6.2 D20.2 D21.2 J1.1(VIN) K1.4(T1) K2.4(T1) X1#2.2
VREF+: C81.1(+) C82.1(+) C83.1(+) IC3#1.9(VREF) L10.2 U8.21(VREF+)
VREF-: C81.2(-) C82.2(-) C83.2(-) L8.2 U8.20(VREF-)
VSSA: C79.2(-) C80#1.2(-) L7.2 L8.1 U8.19(VSSA)
BOOT: CB1.2 R36.2 U8.94(BOOT0)
BUZZER: R31.1 U8.7(PC13-TAMPER-RTC)
CAN_H: C37.1(+) IC2.7(CANH) R21.2 X2#2.2
CAN_L: C37.2(-) IC2.6(CANL) R21.1 X2#2.1
CAN_RX: C38.1(+) IC2.4(RXD) U8.95(PB8)
CAN_TX: IC2.1(TXD) U8.96(PB9)
D0: U8.61(PD14) U9.7(D0)
D1: U8.62(PD15) U9.8(D1)
D2: U8.81(PD0) U9.9(D2)
D3: U8.82(PD1) U9.10(D3)
D4: U8.38(PE7) U9.11(D4)
D5: U8.39(PE8) U9.116(D5)
D6: U8.40(PE9) U9.115(D6)
D7: U8.41(PE10) U9.114(D7)
D8: U8.42(PE11) U9.113(D8)
D9: U8.43(PE12) U9.112(D9)
D10: U8.44(PE13) U9.111(D10)
D11: U8.45(PE14) U9.107(D11)
D12: U8.46(PE15) U9.106(D12)
D13: U8.55(PD8) U9.105(D13)
D14: U8.56(PD9) U9.104(D14)
D15: U8.57(PD10) U9.103(D15)
DCLK: J6.37(DCLK) U9.45(LSHIFT)
DEN: J6.9(DE) U9.49(LDEN)
DITH: J6.47(DITHB) U9.38(GPIO2)
EEPROM_WP: IC1.7(WP) U8.91(PB5)
ESPADC: R44.2 R50.1 U10.2(ADC)
ESPADCEXT: P3#1.1 R50.2
ESPCS0: U10.9(CS0)
ESPEN: R46.2 U10.3(EN)
ESPIO0: R49.2 R54.2 U10.18(IO0)
ESPIO2: LED13.2(K) R51.2 U10.17(IO2)
ESPIO4: P4.3 U10.19(IO4)
ESPIO5: P4.2 U10.20(IO5)
ESPIO9: P4.5 U10.11(IO9)
ESPIO10: P4.4 U10.12(IO10)
ESPIO12: P3#1.3 U10.6(IO12)
ESPIO13: P3#1.4 U10.7(IO13)
ESPIO14: P3#1.2 U10.5(IO14)
ESPIO15: R42#1.1 U10.16(IO15)
ESPIO16: LED10.2(K) R47.1 U10.4(IO16)
ESPMISO: U10.10(MISO)
ESPMOSI: U10.13(MOSI)
ESPSCK: U10.14(SCLK)
FLASH_WP: U6.3(WP/(IO2)) U8.59(PD12)
HSYNC: J6.11(HS) U9.44(LLINE)
I2C_SCL: IC1.6(SCL) R23.1 U8.92(PB6)
I2C_SDA: IC1.5(SDA) R24.1 U8.93(PB7)
JTCK_SWCLK: J3.2 U8.76(PA14)
JTDI: U8.77(PA15)
JTDO_TSWO: U8.89(PB3)
JTMS_SWDIO: J3.3 U8.72(PA13)
LCD_CS_NE1: U8.88(PD7) U9.123(~{CS})
LCD_PWM: R60.2 U8.35(PB0)
LCD_RD_NOE: U8.85(PD4) U9.121(E(!RD!))
LCD_RS_A16: U8.58(PD11) U9.122(D/!C)
LCD_RUN: LED11#1.2(K) U8.34(PC5)
LCD_WR_NWE: U8.86(PD5) U9.120(R/!W!(!WR!))
LED_ERR: LED8#1.2(K) U8.37(PB2)
LED_N: C94.2(-) C95.2(-) IC4#1.3(FB) J6.3(VLED-) J6.4(VLED-) R61.2 R62.2
LED_P: C94.1(+) C95.1(+) D22.2 IC4#1.5(OV) J6.1(VLED+) J6.2(VLED+)
LED_RUN: LED7#1.2(K) U8.36(PB1)
MAX1_A: R14.1 R17.2 U5.6(A) X4#2.1
MAX1_B: R12.1 R14.2 U5.7(B) X4#2.2
MAX1_CTRL: U5.2(~{RE}) U5.3(DE) U8.64(PC7)
MAX1_STATE: LED6#2.2(K) U8.67(PA8)
MAX2_A: R13.1 R16.2 U4.6(A) X3#2.1
MAX2_B: R11.1 R13.2 U4.7(B) X3#2.2
MAX2_CTRL: U4.2(~{RE}) U4.3(DE) U8.60(PD13)
MAX2_STATE: LED5.2(K) U8.63(PC6)
NJTRST: U8.90(PB4)
PE0: P2.10 U8.97(PE0)
PE1: P2.9 U8.98(PE1)
PE2: P2.8 U8.1(PE2)
PE3: P2.7 U8.2(PE3)
PE4: P2.6 U8.3(PE4)
PE5: P2.5 U8.4(PE5)
PE6: P2.4 U8.5(PE6)
REL1: R56#1.1 U8.15(PC0)
REL2: R39.1 U8.16(PC1)
REL3: U8.17(PC2)
REL4: U8.18(PC3)
RESET: C78.1(+) C90.1(+) J6.44(RESET) R32.2 R33.2 R43#1.2 R48#1.1 S1.2 U6.7(~{HOLD/RESET}/(IO3)) U8.14(NRST) U9.127(~{RESET}) U10.1(RESET)
RX1: U5.1(RO) U8.69(PA10)
RX2: J4.2 U8.26(PA3) U10.22(TXD)
RX3: U4.1(RO) U8.48(PB11)
SDIO_CD: D11.2(K) J2.9(CD) U8.84(PD3)
SDIO_CK: D9.2(K) J2.5(CLK_(SCLK)) U8.80(PC12)
SDIO_CMD: D10.2(K) J2.3(CMD_(DIN)) R5.2 U8.83(PD2)
SDIO_D0: D8.2(K) J2.7(DAT0_(DO)) R6.2 U8.65(PC8)
SDIO_D1: D7.2(K) J2.8(DAT1_(NC)) R7.2 U8.66(PC9)
SDIO_D2: D3.2(K) J2.1(DAT2_(NC)) R8.2 U8.78(PC10)
SDIO_D3: D1.2(K) J2.2(CD/DAT3_(CS)) R9.2 U8.79(PC11)
SDIO_STATUS: LED1.2(K) U8.87(PD6)
SHLR: J6.39(L/R) U9.36(GPIO0)
SPI2_CS: R25.1 U6.1(~{CS}) U8.51(PB12)
SPI2_MISO: U6.5(DI/(IO0)) U8.53(PB14)
SPI2_MOSI: U6.2(DO/(IO1)) U8.54(PB15)
SPI2_SCK: U6.6(CLK) U8.52(PB13)
SPI_CS: IC3#1.15(~{CS}) U8.29(PA4)
SPI_MISO: IC3#1.12(DOUT) U8.31(PA6)
SPI_MOSI: IC3#1.14(DIN) U8.32(PA7)
SPI_SCK: IC3#1.16(DCLK) U8.30(PA5)
SSD_PWM: U9.51(PWM)
STBYB: U9.39(GPIO3)
TEMP_SENSOR: A1.2(VOUT) U8.24(PA1)
TFT_B2: J6.17(B2) U9.63(LDATA12)
TFT_B3: J6.16(B3) U9.62(LDATA13)
TFT_B4: J6.15(B4) U9.61(LDATA14)
TFT_B5: J6.14(B5) U9.60(LDATA15)
TFT_B6: J6.13(B6) U9.59(LDATA16)
TFT_B7: J6.12(B7) U9.35(LDATA17)
TFT_G2: J6.25(G2) U9.72(LDATA6)
TFT_G3: J6.24(G3) U9.71(LDATA7)
TFT_G4: J6.23(G4) U9.70(LDATA8)
TFT_G5: J6.22(G5) U9.69(LDATA9)
TFT_G6: J6.21(G6) U9.68(LDATA10)
TFT_G7: J6.20(G7) U9.67(LDATA11)
TFT_R2: J6.33(R2) U9.81(LDATA0)
TFT_R3: J6.32(R3) U9.80(LDATA1)
TFT_R4: J6.31(R4) U9.79(LDATA2)
TFT_R5: J6.30(R5) U9.78(LDATA3)
TFT_R6: J6.29(R6) U9.77(LDATA4)
TFT_R7: J6.28(R7) U9.76(LDATA5)
TOUCH_IRQ: IC3#1.11(~{PENIRQ}) R40.2 U8.33(PC4)
TX1: U5.4(DI) U8.68(PA9)
TX2: J4.3 U8.25(PA2) U10.21(RXD)
TX3: U4.4(DI) U8.47(PB10)
UPDN: J6.40(U/D) U9.37(GPIO1)
USB_N: R2.1 U8.70(PA11)
USB_P: R1.1 U8.71(PA12)
VBAT: BT1.1(+) U8.6(VBAT)
VCOM: C84.1(+) J6.6(VCOM) J6.46(VCOM) R34#1.1 R35#1.1
VSYNC: J6.10(VS) U9.43(LFRAME)
WAKEUP: R32.1 U8.23(PA0-WKUP)
XN: FB2.1 IC3#1.4(X-)
XP: FB4.1 IC3#1.2(X+)
XTAL_IN: C91#1.2(-) U9.22(XTAL_IN) Y3.2(OSC2)
XTAL_OUT: C89.2(-) U9.24(XTAL_OUT) Y3.1(OSC1)
YN: FB1.1 IC3#1.5(Y-)
YP: FB3.1 IC3#1.3(Y+)
NetC10_1: C10.1 D12.1 U2.2(VO) U2.4(VO)
NetC15_1: C15.1 D14.1 U3.2(VO) U3.4(VO)
NetC43_2: C43.2(-) C46.1(+) R26.2
NetC63_1: C63.1(+) U8.9(PC15-OSC32_OUT) Y1.1(OSC1)
NetC64_1: C64.1(+) U8.8(PC14/OSC32_IN) Y1.2(OSC2)
NetC65_2: C65.2(-) C66.2(-) C67.2(-)
NetC68_1: C68.1(+) D16.1 L4.1 U7#1.1(SW)
NetC68_2: C68.2(-) D17.2 D18.2
NetC71_2: C71.2(-) D18.1 D19.1
NetC74_2: C74.2(-) U8.13(OSC_OUT) Y2.1(OSC1)
NetC77_2: C77.2(-) U8.12(OSC_IN) Y2.2(OSC2)
NetD4#2_2: D4#2.2 J1.2(OUTPUT) L1.1
NetD13_1: D13.1 PUSB1.1(VBUS)
NetD20_1: D20.1 K1.5(T2) Q2#1.3(C)
NetD21_1: D21.1 K2.5(T2) Q3#1.3(C)
NetFB1_2: FB1.2 J5.4
NetFB2_2: FB2.2 J5.3
NetFB3_2: FB3.2 J5.2
NetFB4_2: FB4.2 J5.1
NetIC2_8: IC2.8(RS) R22.2
NetIC4#1_1: IC4#1.1(SW) L11.1
NetIC4#1_4: IC4#1.4(EN) R52#1.2 R53.1 R58#1.2 R60.1
NetJ6_7: J6.7(DVDD) J6.8(MODE) R63.2 R64.2
NetK1_1: K1.1(COM) X5.2
NetK1_2: K1.2(NC) X5.1
NetK1_3: K1.3(NO) X5.3
NetK2_1: K2.1(COM) X6.2
NetK2_2: K2.2(NC) X6.1
NetK2_3: K2.3(NO) X6.3
NetLED1_1: LED1.1(A) R4.2
NetLED2_1: LED2.1(A) R10.2
NetLED3_1: LED3.1(A) R15.2
NetLED4_1: LED4.1(A) R18.2
NetLED5_1: LED5.1(A) R19.2
NetLED6#2_1: LED6#2.1(A) R20.2
NetLED7#1_1: LED7#1.1(A) R37.1
NetLED8#1_1: LED8#1.1(A) R38.1
NetLED9#1_1: LED9#1.1(A) R39.2
NetLED9#1_2: LED9#1.2(K) Q2#1.1(B)
NetLED10_1: LED10.1(A) R57.2
NetLED11#1_1: LED11#1.1(A) R55.1
NetLED12#1_1: LED12#1.1(A) R56#1.2
NetLED12#1_2: LED12#1.2(K) Q3#1.1(B)
NetLED13_1: LED13.1(A) R59.2
NetPUSB1_2: PUSB1.2(D-) R2.2
NetPUSB1_3: PUSB1.3(D+) R1.2 R3.2
NetQ1_1: Q1.1(B) R31.2
NetQ1_3: Q1.3(C) SP1.2(-)
NetR27_2: R27.2 R28.1
NetR28_2: R28.2 R29.2 U7#1.3(FB)
NetR41#1_1: R41#1.1 R42#1.2
NetR45#1_2: R45#1.2 U9.128(CONF)
NetR47_2: R47.2 R48#1.2 S2.2
NetR49_1: R49.1 S3.2

Not connected (* = marked no-connect by the designer): IC2 5(VREF)*; IC3#1 7(IN3)* 8(IN4)* 13(BUSY)*; J6 45(NC)* 49(NC)* 50(NC)*; PUSB1 4(ID); U9 15(CLK)* 28(LDATA23)* 29(LDATA22)* 30(LDATA21)* 31(LDATA20)* 50(TE)* 52(GAMAS0)* 53(GAMAS1)* 85(LDATA19)* 86(LDATA18)* 87(D19)* 88(D18)* 89(D23)* 90(D22)* 91(D21)* 92(D20)* 98(D17)* 99(D16)*

## Layout directives
differential pair: USB_N, USB_P

## Notes on the sheet
- (in symbol CON_Micro SD) SD (SPI)

## Library data of the parts
A1 = LM35DZ/NOPB: Temperature Sensor Analog, Local 0Â°C ~ 100Â°C 10mV/Â°C TO-92-3; MF: Texas Instruments; MP: LM35DZ; Package: TO-226-3 Misc; Value: *; Price: None; SnapEDA_Link: https://www.snapeda.com/parts/LM35DZ/Texas%20Instruments/view-part/891192/?ref=snap; Availability: Unavailable; Check_prices: https://www.snapeda.com/parts/LM35DZ/Texas%20Instruments/view-part/891192/?ref=eda
BT1 = Battry Backup: Designer: Abbas Basereh; Data: 16-12-2016; Link: *; Part. No: *
C1 C2 C16-C20 C21#1-C21#3 C22#1 C22#2 C23-C33 C34#1 C34#2 C35#1 C35#2 C36-C39 C41 C42#1 C42#2 C43 C44#1 C63-C65 C68 C70 C72-C74 C77-C79 C80#1 C80#2 C81-C87 C89 C90 C91#1 C91#2 C93 C94 C?#1-C?#4 = Cap-Bipolar: Bipolar Capacitor; Voltage: 100V; Designer: Saeid Jorablo; Organazation: ControTec; Adding Date: 1387/12/20
  C1 C2 C16 C18-C20 C21#1-C21#3 C22#1 C22#2 C23-C33 C34#1 C34#2 C35#2 C36 C38 C39 C41 C42#1 C42#2 C43 C44#1 C65 C68 C70 C72 C73 C78 C79 C80#2 C83 C87 C90 C91#2 C93 C94: Value: 100nF
  C17 C35#1 C37 C85 C86 C?#2-C?#4: Value: 100pF
  C63 C64 C74 C77 C81 C89 C91#1: Value: 20pF
  C80#1: Value: 47nF
  C82: Value: 1uF
  C84: Value: 1nF
C3 C10 C15 = CAP_SMD_TAN_10uF_35V: CAP, SMD, TAN; PARAM: 20%, 300mOhm, -55~125oC; MANF: VISHAY; MANF_P#: 593D106X9035D2TE3; PARAM2: 35V; PRICE: 0.8$; VALUE: 10uF
C4 C5 C8 C9 = CAP_SMD_EL_330u25V: CAP, SMDD, ELEC, 330uF, 25V; MANF_P#: EEE-1EA331UP; PARAM2: 20%; MANF: PANASONIC; DESC: DESCRIPTION; DIST#: MOUSER; PRICE: 10= 5$; ASSEMBLY: ASSEMBLY; PARAM: 25V; VALUE: 330uF
C6 C7 C11-C14 C40 C44#2 C45 C46 C66 C67 C69 C71 C75 C76 C88 C92 C95 = Cap-Polar: Polar Capacitor; Designer: Saeid Jorablo; Organazation: ControTec; Adding Date: 1387/12/20
  C6 C7 C11-C14 C40 C44#2 C45 C46 C75 C76 C88: Value: 100uF
  C66 C69: Value: 10uF 16V
  C67 C71: Value: 10uF 25V
  C92: Value: 4.7uF 16V
  C95: Value: 2.2uF 25V
C47-C62 = Cap-Bipolar: Bipolar Capacitor; Voltage: 100V; Adding Date: 1387/12/20; Value: 10nF
D1 D3 D7-D11 = DIODE_1N4148: Designer: Eng. Saeid Jorablo; Company: SJ Libraries; Published: 8-Jun-2000; LatestRevisionDate: 17-Jul-2002; LatestRevisionNote: Re-released for DXP Platform.; PackageReference: DO-35; Publisher: SJ Unlimited; PackageDescription: Diode, Axial; Body 3.8 x 1.9 mm (LxDia. max), Lead Dia. 0.53 mm (max); Code_JEDEC: DO-204-AH; ComponentLink1Description: Datasheet; ComponentLink1URL: http://www.fairchildsemi.com/; ComponentLink2Description: Reference; ComponentLink2URL: http://www.fairchildsemi.com/ds/1N%2F1N4148.pdf; Mounting Technology: Surface Mount\Through-Hole; HelpURL: http://s3.picofile.com/file/7443264187/Coming_Soon_logo.gif; Status: Unreleased
D2 D4#2 D5#2 D6 D12 D14 = DIODE_SMD_SCHOTTKY_30BQ100TRPBF: DIODE, SCHOTTKY, 100V, 3A; MANF: Vishay; DESC: DESCRIPTION; MANF_P#: 30BQ100TRPBF; ASSEMBLY: ASSEMBLY; PRICE: PRICE; PARAM2: 3A; PARAM: 100V; VALUE: 30BQ100TRPBF
D4#1 D5#1 D13 D16-D18 D20-D22 = DIODE_SMD_SCHOTTKY_1N5822: DIODE, SCHOTTKY, 40V, 3A; MANF: DIODES; DESC: DESCRIPTION; MANF_P#: 1N5822; ASSEMBLY: ASSEMBLY; PRICE: PRICE; PARAM2: 3A; PARAM: 40V; VALUE: 1N5822
D15 = DIODE_SMD_ZENER_3SMAJ5919B: DIODE, ZENER, 3W, 5.6V; MANF: MCC; DESC: DESCRIPTION; PARAM2: 0.5W, 2Ohm, 67mA, -55~150oC; MANF_P#: 3SMAJ5919B-TP; ASSEMBLY: ASSEMBLY; PRICE: 0.5$; PARAM: 5.6V; VALUE: ZENER 5V6
D19 = DIODE_SMD_ZENER_3SMAJ5919B: DIODE, ZENER, 3W, 9.1V; MANF: MCC; DESC: DESCRIPTION; PARAM2: 0.5W, 2Ohm, 67mA, -55~150oC; PARAM: 5.6V; MANF_P#: 3SMAJ5919B-TP; ASSEMBLY: ASSEMBLY; PRICE: 0.5$; VALUE: ZENER 9V1
D?#1-D?#8 = 1N4148UR-1: DIODE GEN PURP 75V 200MA DO213AA; Published: 2017-1-12; PackageVersion: 2017-1-12; PackageReference: DO-213AA&SOD-80; Publisher: Abbas Basereh; PackageDescription: DIODE GEN PURP 75V 200MA DO213AA; ComponentLink1Description: Manufacturer Link; ComponentLink1URL: http://www.digikey.com/product-detail/en/microsemi-corporation/1N4148UR-1/1N4148UR-1-ND/4377991; ComponentLink2Description: Datasheet; PART.NO: 1N4148UR-1
FB1-FB4 = FBEAD_SMD: FERRITE_Bead, SMD; MANF: MURATA; PARAM: 120@100MHz; PARAM2: 1A; MANF_P#: BLM15AG121SN1D; VALUE: FB603
G1-G7 R1-R20 R26-R31 R34#1 R34#2 R35#1 R35#2 R39 R41#1 R42#1 R42#2 R43#1 R44 R45#1 R45#2 R46 R47 R48#1 R49-R51 R52#1 R52#2 R53 R54 R56#1 R57 R58#1 R58#2 R59-R64 = RES SMD PACKAGE: TOTAL SMD RESISTOR PACK; Designer: Abbas Basereh; Desc.: RES SMD PAKAGES; Data: 2017-3-10
  G1-G7 R1-R4 R10 R15 R18-R20 R27 R31 R34#2 R35#2 R39 R41#1 R42#2 R44 R45#1 R45#2 R47 R48#1 R49 R50 R52#1 R52#2 R53 R56#1 R57 R58#1 R58#2 R59-R62: VALUE: 1K
  R26: VALUE: 0R
  R28 R30 R34#1: VALUE: 10K
  R29: VALUE: 120K
  R35#1: VALUE: 30K
  R42#1 R43#1 R46 R51 R54: VALUE: 12K
IC1 = IC_AT24c256: EEPROM Memory; Designer: Eng. Saeid Jorablo; Company: SJ Libraries; Revision 2: 7/1/2012: Add Suppliers; ESD Sensetive: True/False; ComponentLink1Description: Datasheet; ComponentLink1URL: www.datasheet4u.com; ComponentLink2Description: Reference; PinCount: 8; Update: 6/5/2012; Supplier 1: Digi-Key; Supplier 2: Digi-Key; Supplier 3: Digi-Key; Supplier Part Number 1: AT24C256-10TI-2.7-ND; Supplier Part Number 2: AT24C256N-10SC-ND; Supplier Part Number 3: AT24C256-10PI-2.7-ND; Category: Integrated Circuit; Status: Unrelease; HelpURL: http://s3.picofile.com/file/7443264187/Coming_Soon_logo.gif; Operating Temperature: -55 ~ +125 (C); Mounting Technology: Surface Mount; RoHS compliant: True/False
IC2 = MCP2551-I/SN: 1/1 Transceiver Half CANbus 8-SOIC; MF: Microchip; Price: None; SnapEDA_Link: https://www.snapeda.com/parts/MCP2551-I/SN/Microchip/view-part/10929/?ref=snap; MP: MCP2551-I/SN; Value: *; Availability: Unavailable; Package: SOIC-8 Microchip
IC3#1 = ADS7843E: Integrated Circuit; Manufacturer_Name: Texas Instruments; Datasheet Link: http://www.ti.com/lit/ds/symlink/ads7843.pdf; Height: 1.75mm; Manufacturer_Part_Number: ADS7843E; Arrow Part Number: ADS7843E; Arrow Price/Stock: https://www.arrow.com/en/products/ads7843e/texas-instruments; Mouser Part Number: 595-ADS7843E; Mouser Price/Stock: https://www.mouser.com/Search/Refine.aspx?Keyword=595-ADS7843E
IC3#2 IC4#2 IC5 IC7 = PC817X1NIP1B: Integrated Circuit; Manufacturer_Name: Sharp Microelectronics; Datasheet Link: https://cdn.sharpsde.com/fileadmin/products/Optoelectronics/Isolation%20Devices/Specs%20Photocoupler/PC817XxNIP1B_12Oct16_Spec_ED-16P011.pdf; Height: 4.2mm; Manufacturer_Part_Number: PC817X1NIP1B; Arrow Part Number: PC817X1NIP1B; Arrow Price/Stock: https://www.arrow.com/en/products/pc817x1nip1b/sharp; Mouser Part Number: 852-PC817X1NIP1B; Mouser Price/Stock: https://www.mouser.co.uk/ProductDetail/Sharp-Microelectronics/PC817X1NIP1B?qs=rrS6PyfT74ek9MvelH%252BjIg%3D%3D
IC4#1 = MP3202DJ-LF-P: Integrated Circuit; Manufacturer_Name: Monolithic Power Systems (MPS); Datasheet Link: http://www.monolithicpower.com/DesktopModules/DocumentManage/API/Document/GetDocument?id=1215; Height: 1mm; Manufacturer_Part_Number: MP3202DJ-LF-P; Mouser Part Number: 946-MP3202DJLFP; Mouser Price/Stock: https://www.mouser.co.uk/ProductDetail/Monolithic-Power-Systems-MPS/MP3202DJ-LF-P?qs=rC7bBWoQAAnkWXT%252BwQ2sJQ%3D%3D
J1 = LM2596S-5.0_TR: Connector; Manufacturer_Name: National Electronics; Manufacturer_Part_Number: LM2596S-5.0/TR; Datasheet Link: https://www.jameco.com/Jameco/Products/ProdDS/895246.pdf; Height: 4.65mm
J2 = CON_Micro SD: Secure Digital Card Socket; Max Current: mA; designer: Eng. Saeid Jorablo; Company: SJ Libraries; Connector type: Header; Mounting Technology: Surface Mount; Status: Unreleased; Category: Connector; Pin Count: 13; Publisher: SJ UnLimited; ComponentLink1Description: Datasheet; ComponentLink2Description: Reference; Update: 7/8/2012; HelpURL: http://s3.picofile.com/file/7443264187/Coming_Soon_logo.gif
J3-J5 = HDR_M_1X4: CONN, HEADER, Male, pitch: 2.54mm, 4POS; VALUE: HDRM4
J6 = FPC50_50: CONN, FPC, 0.50mm pitch, RightAngle, Bot. Contact; MANF: Hirose; MANF_P#: FH12-50S-0.5SH; VALUE: FPC_0.5mm_50
K1-K4 = Relay_SPDT: Single-Pole Dual-Throw Relay; Designer: Abbas Basereh; Mounting Technology: Through-Hole; ComponentLink1Description: Datasheet; Pin Count: 0; Update Date: 2017-3-1
L1 L4 L11 = INDPWR_SMD: INDUCTOR, POWER, SMD; VALUE: 10uH
L2 L3 L5-L10 = Inductor: Code_IEC: 1005; Published: 8-Jun-2000; LatestRevisionDate: 29-May-2009; LatestRevisionNote: IPC-7351 Footprint Added.; PackageReference: 0402-A; Publisher: Altium Limited; PackageDescription: Chip Inductor; Code_JEITA: 0402
LED1-LED5 LED6#1 LED6#2 LED7#1 LED7#2 LED8#1 LED8#2 LED9#1 LED9#2 LED10 LED11#1 LED11#2 LED12#1 LED12#2 LED13 = LED: Designer: Saeid Jorablo; Organazation: ControTec; Adding Date: 1387/12/22; Color: Red
  LED6#1 LED7#2 LED8#2 LED9#1 LED9#2 LED11#2 LED12#1 LED12#2: Size: SMD 1206
P1 = FHDR_1X02: Female Header 1X02
P2 = MHDR_1X10: Male Header 1X10
P3#1 = MHDR_1X06: Male Header 1X06
P3#2 = DB9 Connector: Receptacle Assembly, 9 Position, Right Angle; PackageDocument: O; Positions: 9; Published: 15-Jun-2001; LatestRevisionDate: 17-Jul-2002; LatestRevisionNote: Re-released for DXP Platform.; DatasheetDocument: 1-Sep-1999; PackageReference: 788750; Publisher: Altium Limited; Orientation: Right Angle; Gender: Receptacle
P4 = MHDR_1X05: Male Header 1X05
PUSB1 = CONN_USB_MICRO_AB_BM_SHS: CONN, USB, MICRO AB, R/A, SMD, BOTTOM MOUNT; MANF_P#: 1981584-1; MANF: TE; PARAM2: 30VAC; PARAM: 1.8A, -30~85oC; MANF_P#2: HIROSE ZX62-AB-5PA; PRICE: 0.75$; VALUE: CONN_USB_MICROB
Q1 Q2#1 Q3#1 Q3#2 Q4#1 = NPN: NPN Bipolar Transistor; Published: 8-Jun-2000; LatestRevisionDate: 29-May-2009; LatestRevisionNote: IPC-7351 Footprint Added.; PackageVersion: Aug-1999; PackageReference: SOT-23B; Publisher: Altium Limited; PackageDescription: 3-Pin SOT-23 Package 0.95 mm Pitch, 2.4 mm Lead Span
Q2#2 Q3#3 Q4#2 Q6 = IRF9540NSTRLPBF: RoHS Compliant | Low RDS_on_ | Industry-leading quality | Dynamic dv/dt Rating | Fast Switching | Fully Avalanche Rated | 175C Operating Temperature | P-Channel MOSFET; MF: Infineon; Availability: Unavailable; SnapEDA_Link: https://www.snapeda.com/parts/IRF9540NSTRLPBF/Infineon%20Technologies/view-part/565416/?ref=snap; MP: IRF9540NSTRLPBF; Price: None; Value: *; Package: D2PAK Infineon
R21 = res1: Resistor; Value: 60R; Published: 8-Jun-2000; Revision: July-2002: Re-released for DXP Platform.; Publisher: Altium Limited
R22 = res1: Resistor; Published: 8-Jun-2000; Revision: July-2002: Re-released for DXP Platform.; Publisher: Altium Limited
R23-R25 R32 R33 R36 R40 = res1: Resistor; Value: 1K; Published: 8-Jun-2000; Revision: July-2002: Re-released for DXP Platform.; Publisher: Altium Limited
R37 R38 R41#2 R43#2 R48#2 R55 R56#2 = RES SMD PACKAGE: TOTAL SMD RESISTOR PACK; Desc.: RES SMD PAKAGES; Data: 2017-3-10
S1-S3 = SW-PB: Switch; Published: 24-Mar-1999; LatestRevisionDate: 17-Jul-2002; LatestRevisionNote: Re-released for DXP Platform.; PackageReference: SPST-2; Publisher: Altium Limited
SP1 = PIEZO BUZZER: PIEZO BUZZER ACTIVE; Designer: Abbas Basereh; Comment_1: SPEAKER AND BEEP; Design Date: 1395/11/14; ComponentLink2Description: Reference; PackageDescription: THD; Publisher: Abbas Basereh; Mounting Technology: THD; Pin Count: 2; Status: Unreleased
U1-U3 = VREG_1117_SOT223: REG, Linear, LDO1V, 0.8A, SOT-223; MANF_P#: LD1117, LM1117, AMS1117, TLV1117, REG1117, NCP1117, LT1117, SPX1117; MANF: TI, ON, ST; PARAM2: 1.2/1.5/1.8/2.5/2.85/3.3/5V; PARAM: LDO1V, 0.8A
U4 U5 = MAX485ESA+T: 1/1 Transceiver Half RS422, RS485 8-SOIC; MF: Maxim Integrated; Digi-Key_Purchase_URL: https://www.digikey.hu/product-detail/en/maxim-integrated/MAX485ESA-T/MAX485ESA-TCT-ND/3647897?utm_source=snapeda&utm_medium=aggregator&utm_campaign=symbol; Digi-Key_Part_Number: MAX485ESA+TCT-ND; SnapEDA_Link: https://www.snapeda.com/parts/MAX485ESA%2BT/Maxim%20Integrated/view-part/549140/?ref=snap; Package: SOIC-8 Maxim; Value: *; MP: MAX485ESA+T
U6 = W25Q128FVSIG: Serial Flash; Manufacturer: Winbond; Datasheet: https://www.winbond.com/resource-files/w25q128fv rev.m 05132016 kms.pdf; Part Number: W25Q128FVSIG; Link: https://eu.mouser.com/ProductDetail/Winbond/W25Q128FWSIG?qs=sGAEpiMZZMtI%252BQ06EiAoG4%252BhDIVn9lGKRKFnn2qg8I0%3D; Type: SMD; Value: W25Q128JVSIM TR; Order_ID: W25Q128JVSIM TR
U7#1 = TPS61040DBVR: 28-V, 400-mA Switch Boost Converter in SOT-23 for LCD and White LED Applications; MF: Texas Instruments; Value: *; Package: SOT-23-5 Texas Instruments; Price: None; MP: TPS61040DBVR; Texas_Instruments-Purchase-URL: https://snapeda.com/shop?store=Texas+Instruments&id=218715; Availability: Unavailable; Mouser-Purchase-URL: https://snapeda.com/shop?store=Mouser&id=218715; DigiKey-Purchase-URL: https://snapeda.com/shop?store=DigiKey&id=218715; SnapEDA_Link: https://www.snapeda.com/parts/TPS61040DBVR/Texas%20Instruments/view-part/218715/?ref=snap
U7#2 = MAX3232CD: 3-V to 5.5-V multichannel RS-232 line driver & receiver 16-SOIC 0 to 70; MF: Texas Instruments; Value: *; SnapEDA_Link: https://www.snapeda.com/parts/MAX3232CD/Texas%20Instruments/view-part/46241/?ref=snap; MP: MAX3232CD; Texas_Instruments-Purchase-URL: https://snapeda.com/shop?store=Texas+Instruments&id=46241; Availability: Good; Price: None; Mouser-Purchase-URL: https://snapeda.com/shop?store=Mouser&id=46241; Package: SOIC-16 Texas Instruments; DigiKey-Purchase-URL: https://snapeda.com/shop?store=DigiKey&id=46241; BuyPart: https://www.snapeda.com/parts/MAX3232CD/Texas%20Instruments/view-part/46241/?ref=eda
U8 = STM32F103VET6: ARMÂ® CortexÂ®-M3 STM32F1 Microcontroller IC 32-Bit 72MHz 512KB _512K x 8_ FLASH; MF: STMicroelectronics; Package: LQFP-100 STMicroelectronics; Value: *; Price: None; MP: STM32F103VET6; Availability: Unavailable; SnapEDA_Link: https://www.snapeda.com/parts/STM32F103VET6/STMicroelectronics/view-part/10802/?ref=snap
U9 = SSD1963QL9: LCD Display Controller 128-Pin LQFP; MF: Solomon Systech; SnapEDA_Link: https://www.snapeda.com/parts/SSD1963QL9/Solomon%20Systech/view-part/446704/?ref=snap; Price: None; Availability: Unavailable; Package: None; MP: SSD1963QL9; Value: *
U10 = ESP8266-12E/ESP-12E: This WiFi module has a 32-bit MCU micro and clock speeds supporting 80 MHz or 160 MHz. Supports the RTOS and integrated Wi-Fi MAC/BB/RF/PA/LNA, and has an on-board antenna.; MF: AI-Thinker; Price: None; Package: None; Value: *; MP: ESP8266-12E/ESP-12E; Availability: Unavailable; SnapEDA_Link: https://www.snapeda.com/parts/ESP8266-12E/ESP-12E/AI-Thinker/view-part/106414/?ref=snap
X1#1 X2#1 X2#2 X3#1 X3#2 X4#1 X4#2 = CON_Phoenix_MKDSN_02: Manufacturer: PHOENIX CONTACT; Company: SJ Libraries; Connector type: PCB Terminal Block; designer: Eng. Saeid Jorablo; Max Current: 13.5 A; Positions: 2; Revision 1: 2012/10/1 : Adding Model; Voltage: 400 V; Category: Connector; ComponentLink1Description: Datasheet; ComponentLink2Description: Reference; HelpURL: http://s3.picofile.com/file/7443264187/Coming_Soon_logo.gif; Mounting Technology: Through-Hole; Pin Count: 2; Publisher: SJ UnLimited; Status: Unreleased; Update: 2012/10/1
X1#2 X5 X6 X?#1 X?#2 = CON_Phoenix_MKDSN_03: Manufacturer: PHOENIX CONTACT; Company: SJ Libraries; Connector type: PCB Terminal Block; designer: Eng. Saeid Jorablo; Max Current: 13.5 A; Positions: 3; Revision 1: 2012/10/1 : Adding Model; Voltage: 400 V; Category: Connector; ComponentLink1Description: Datasheet; ComponentLink2Description: Reference; HelpURL: http://s3.picofile.com/file/7443264187/Coming_Soon_logo.gif; Mounting Technology: Through-Hole; Pin Count: 3; Publisher: SJ UnLimited; Status: Unreleased; Update: 2012/10/1
Y1-Y3 = XTAL: XTAL Crystal; Company: E.P.I.L; Design Date: 11/04/2011
  Y1: Value: 32768
  Y2 Y3: Value: 12
CB1 = Circuit Breaker: Published: 24-Mar-1999; LatestRevisionDate: 17-Jul-2002; LatestRevisionNote: Re-released for DXP Platform.; PackageReference: SPST-2; Publisher: Altium Limited; PackageDescription: Switch; 2 Leads